# EAGLE board elk-board (EAGLE 9.4.2), part 1 of 3
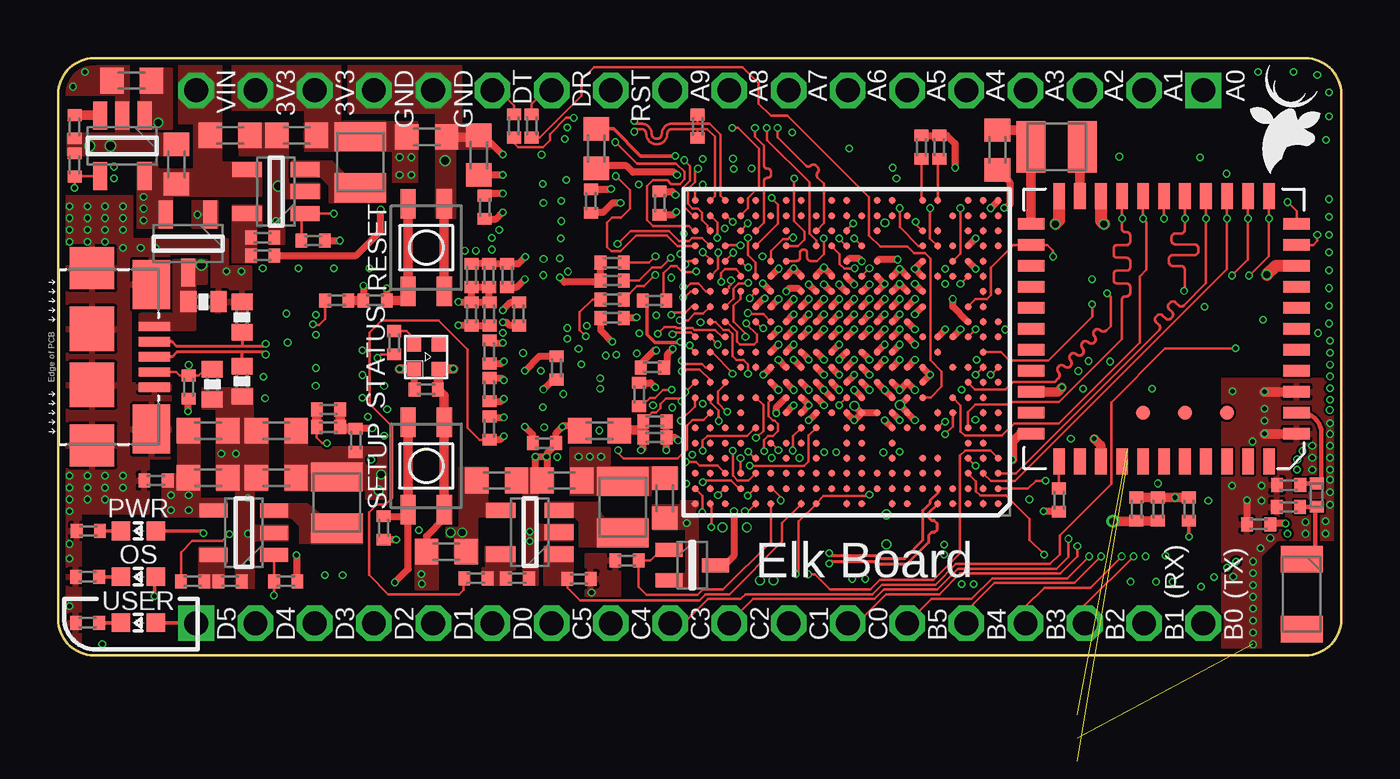
[diagram p8: board, top side]
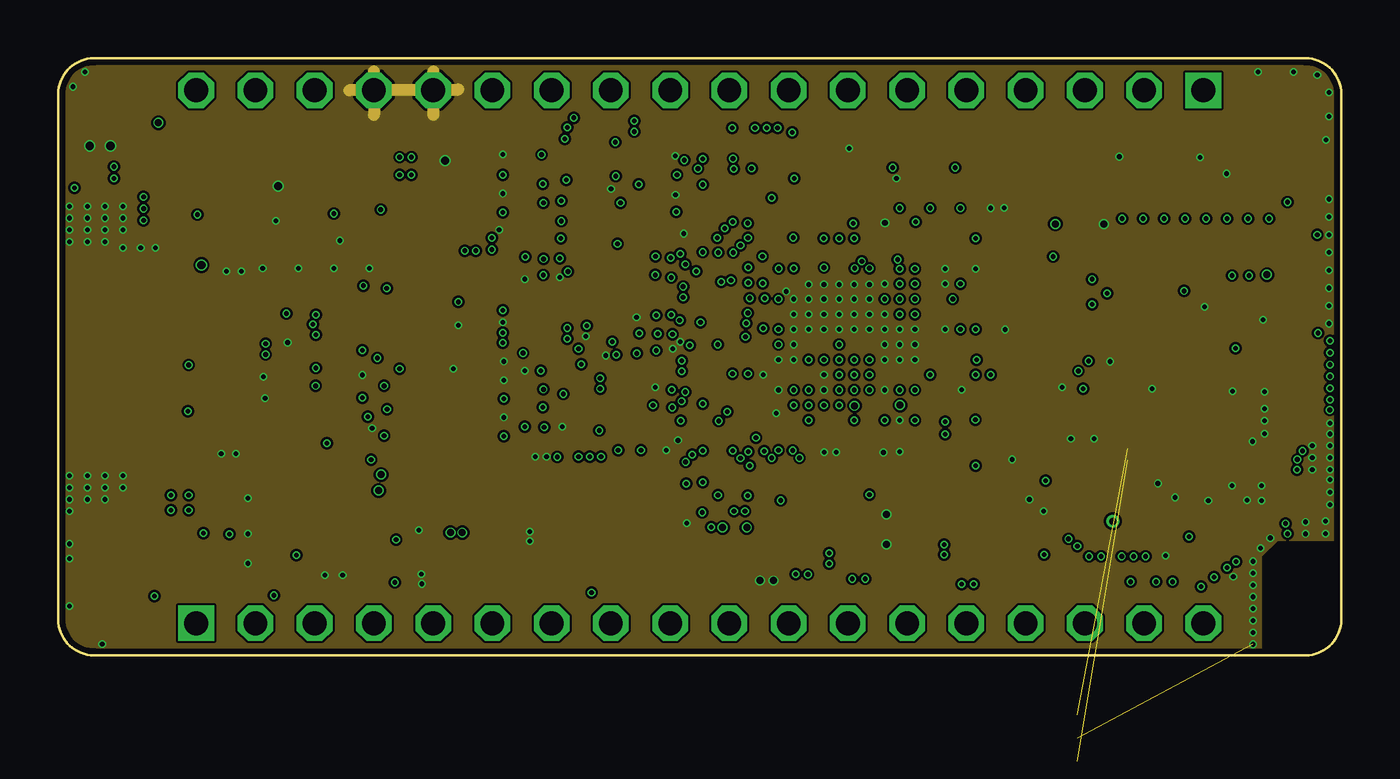
[diagram p9: board, inner layer GND1]
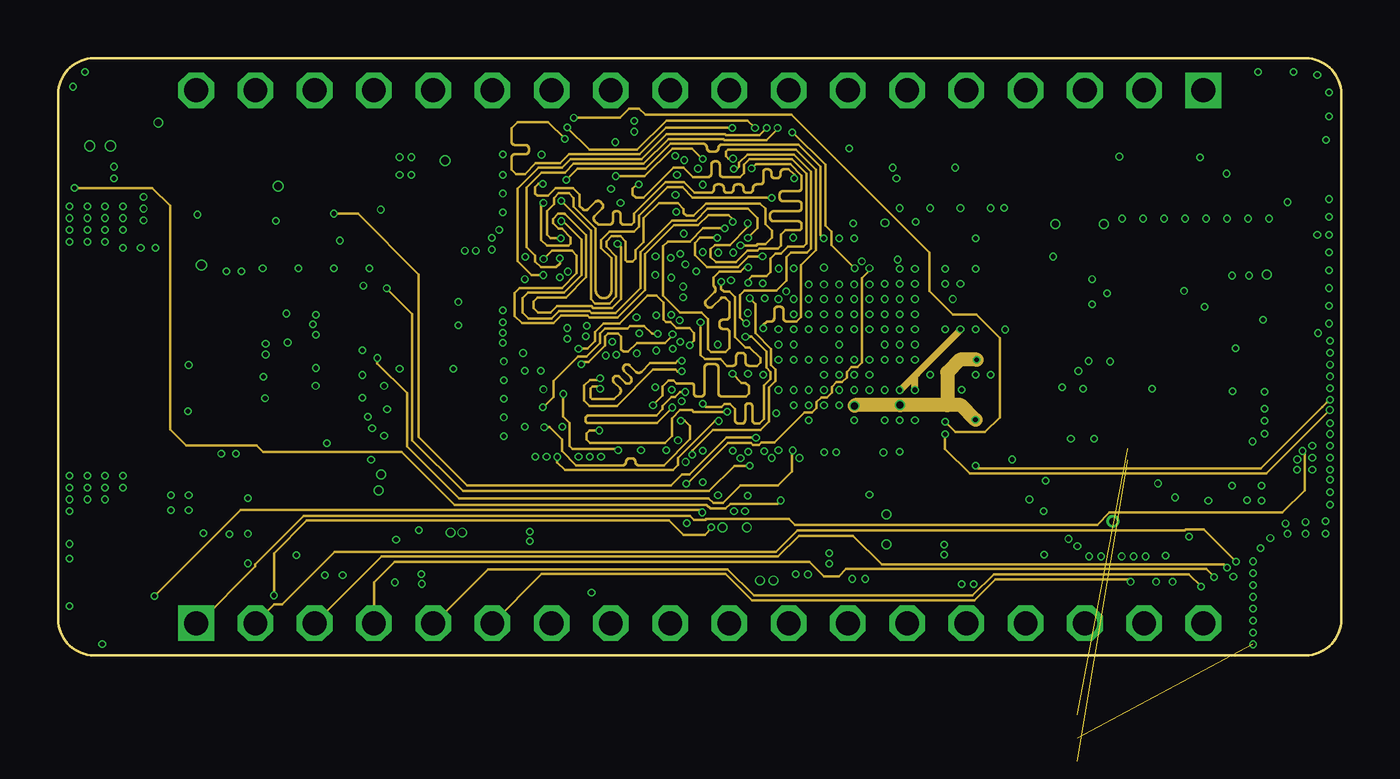
[diagram p10: board, inner layer SIG1_RAM]
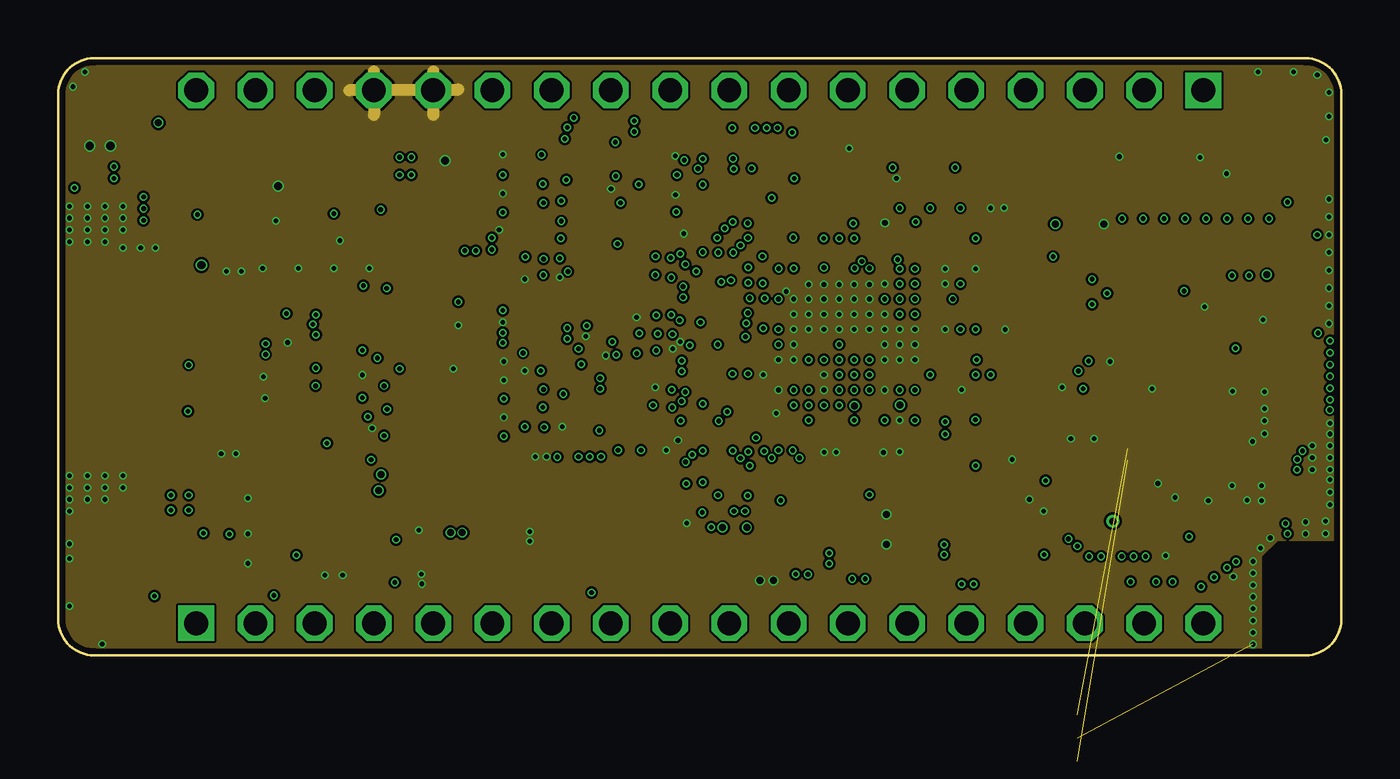
[diagram p11: board, inner layer GND2]
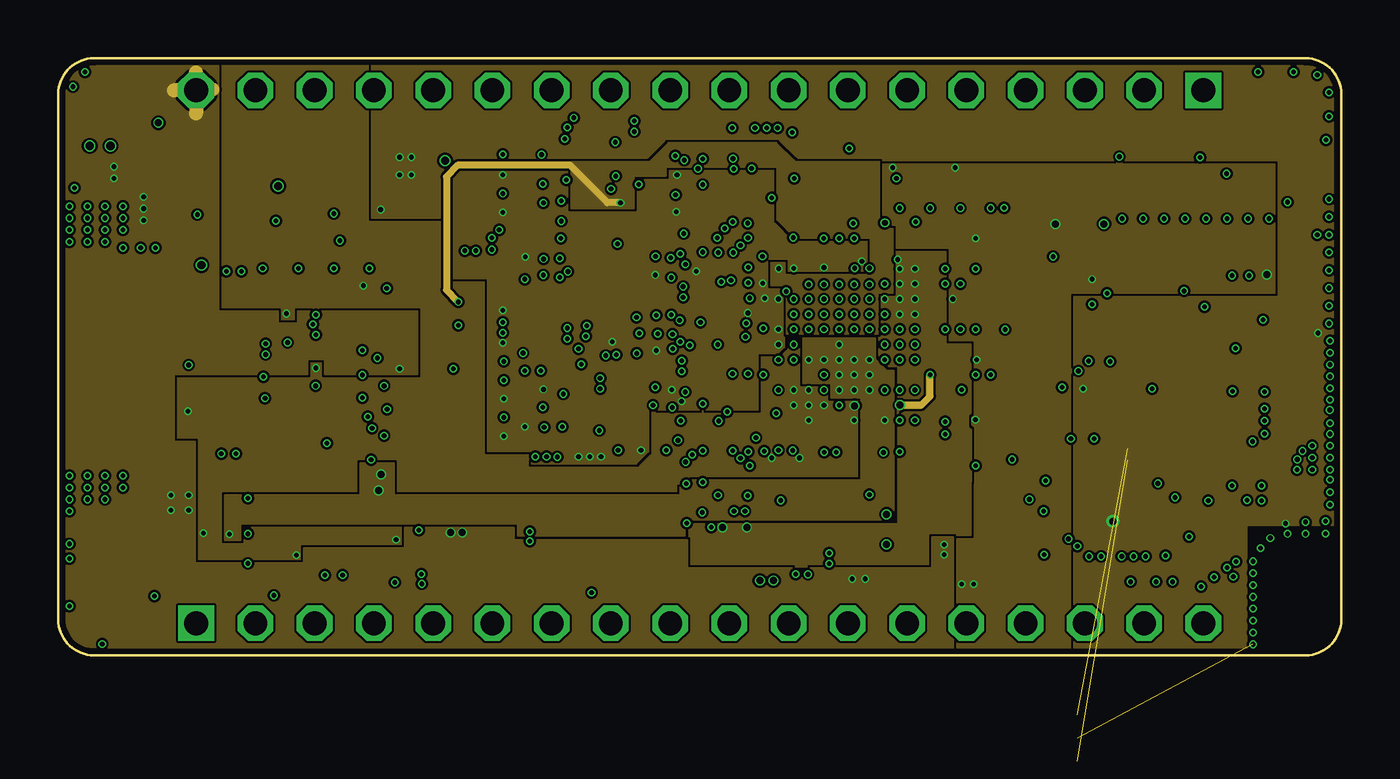
[diagram p12: board, inner layer PWR]
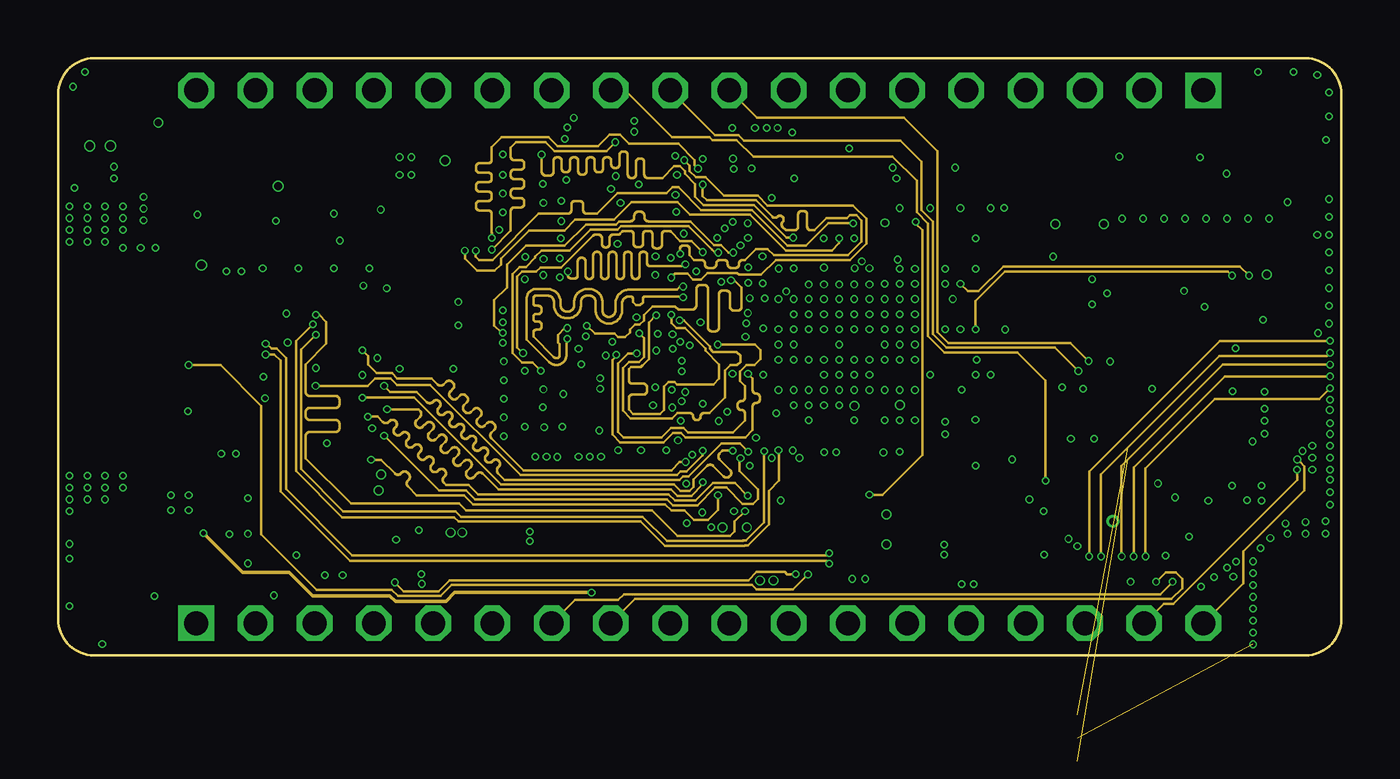
[diagram p13: board, inner layer SIG2_RAM]
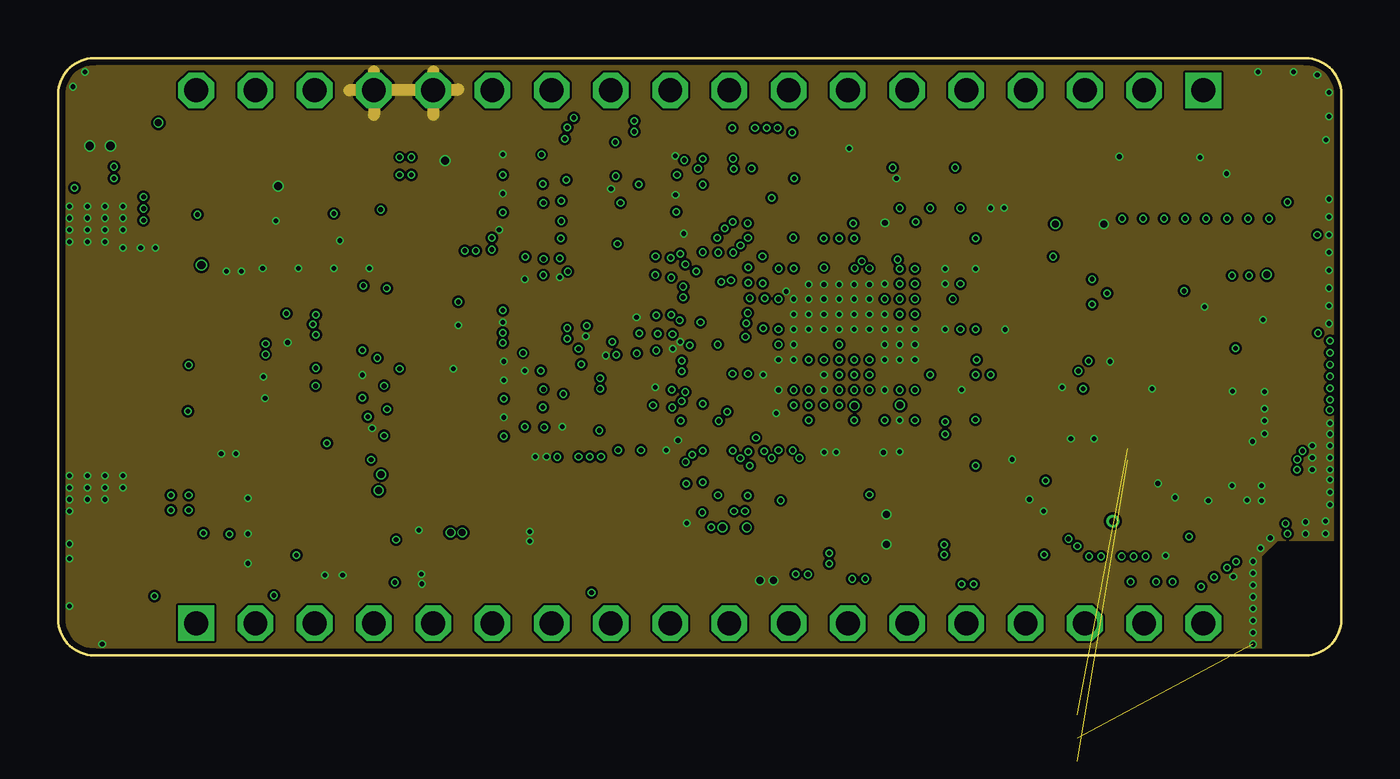
[diagram p14: board, inner layer GND3]
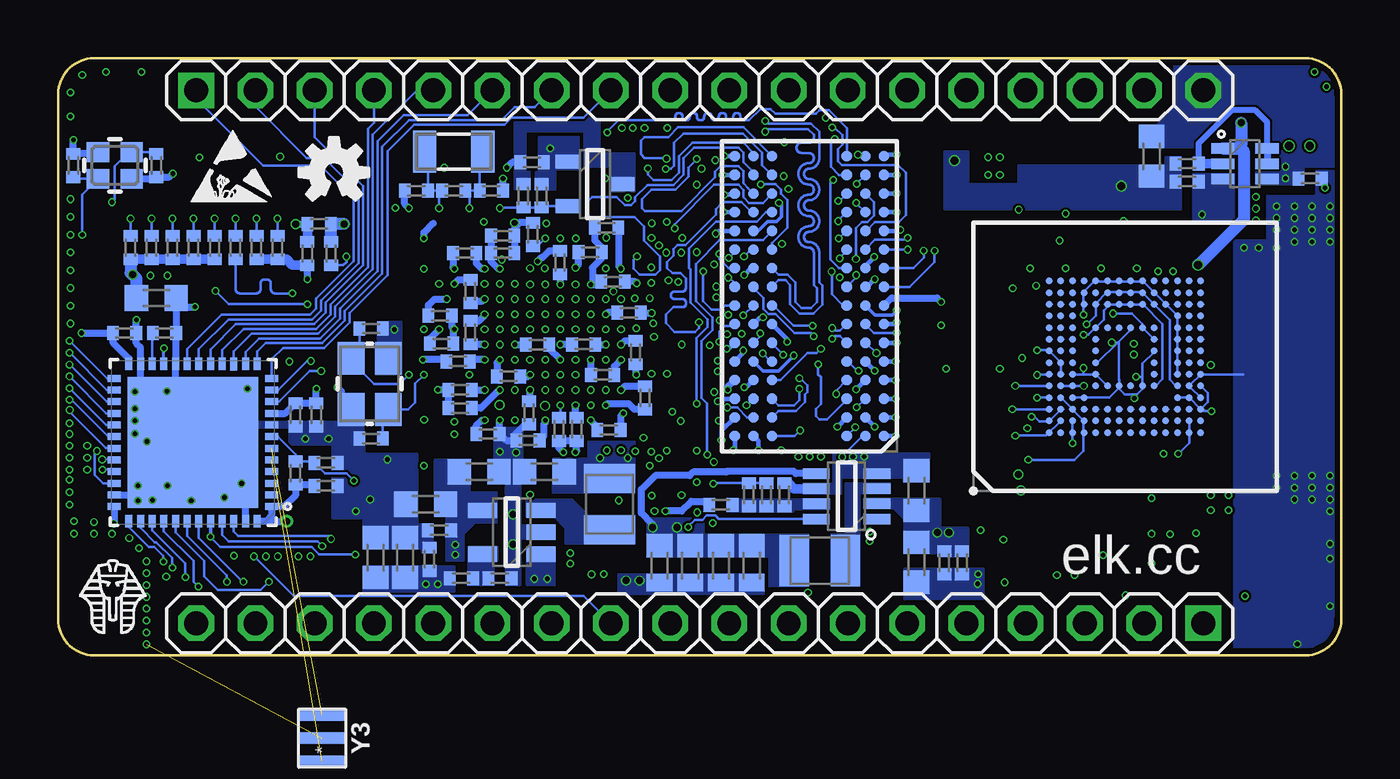
[diagram p15: board, bottom side, seen from below]

Size 55 x 25.6 mm. Coordinates in mm from the lower left corner, seen from the top.
Outline: 55,1.52 55,24.08 arc90 53.48,25.6 1.52,25.6 arc90 0,24.08 0,1.52 arc90 1.52,0 53.48,0 arc90 55,1.52
Copper layers (1*2+3*4+13*14+15*16): Top 0.035mm / dielectric 0.1mm / GND1 0.035mm / dielectric 0.18mm / SIG1_RAM 0.035mm / dielectric 0.2mm / GND2 0.035mm / dielectric 0.33mm / PWR 0.035mm / dielectric 0.2mm / SIG2_RAM 0.035mm / dielectric 0.18mm / GND3 0.035mm / dielectric 0.1mm / Bottom 0.035mm
Design rules "Olinuxino H3 *": minimum track width 4mil, minimum drill 0.2mm, track to track 4mil, track to pad 4mil, pad to pad 4mil, via to via 4mil, smd to smd 0mil, copper to edge 10mil, drill to drill 8mil, minimum pad ring 6mil, minimum via ring 2.5mil, stop-mask expansion 2mil, vias tented up to drill 25mil, thermal gap 5mil
Net classes: 1 DRAM_ADD_CMD: width 0.102 mm; 5 DRAM_CLOCK: width 0.114 mm, clearance 0.305 mm to class 0, clearance 0.305 mm to class 1, clearance 0.305 mm to class 2, clearance 0.305 mm to class 3, clearance 0.305 mm to class 4, clearance 0.121 mm; 6 DIFF100: width 0.114 mm, clearance 0.305 mm to class 0, clearance 0.305 mm to class 1, clearance 0.305 mm to class 2, clearance 0.305 mm to class 3, clearance 0.305 mm to class 4, clearance 0.305 mm to class 5, clearance 0.121 mm; 7 DIFF90: width 0.135 mm, clearance 0.305 mm to class 0, clearance 0.305 mm to class 1, clearance 0.305 mm to class 2, clearance 0.305 mm to class 3, clearance 0.305 mm to class 4, clearance 0.305 mm to class 5, clearance 0.305 mm to class 6, clearance 0.109 mm; 8 SDC2: clearance 0.305 mm to class 5, clearance 0.305 mm to class 6, clearance 0.305 mm to class 7; 9 SDC1: clearance 0.305 mm to class 5, clearance 0.305 mm to class 6, clearance 0.305 mm to class 7; 10 1.2V: clearance 0.305 mm to class 5, clearance 0.305 mm to class 6, clearance 0.305 mm to class 7; 11 1.5V: clearance 0.305 mm to class 5, clearance 0.305 mm to class 6, clearance 0.305 mm to class 7; 12 3.3V: clearance 0.305 mm to class 5, clearance 0.305 mm to class 6, clearance 0.305 mm to class 7; 13 Antenna: width 0.179 mm, clearance 0.102 mm to class 0, clearance 0.305 mm to class 5, clearance 0.305 mm to class 6, clearance 0.305 mm to class 7; 14 MPU_X24M: clearance 0.305 mm to class 5, clearance 0.305 mm to class 6, clearance 0.305 mm to class 7; 15 MPU_X32K: clearance 0.305 mm to class 5, clearance 0.305 mm to class 6, clearance 0.305 mm to class 7

## Footprints (pad centres in the part's own frame; a part is rotated, then mirrored left to right if it is on the bottom)
ANTC3216X140N = smd 1.15 x 1.8: 1 -1.5,0; 2 1.5,0
0402 = smd 0.5 x 0.6: 1 -0.5,0; 2 0.5,0
0603 = smd 1 x 1.1: 1 -0.85,0; 2 0.85,0
TOLBA_0603 = smd 1 x 1.1: 1 -0.85,0 | smd 0.75 x 1.1: 2 0.725,0
BGA153C50P14X14_1150X1300X80 = smd 0.29 x 0.29: A1 -3.25,3.25; A2 -2.75,3.25; A3 -2.25,3.25; A4 -1.75,3.25; A5 -1.25,3.25; A6 -0.75,3.25; A7 -0.25,3.25; A8 0.25,3.25; A9 0.75,3.25; A10 1.25,3.25; A11 1.75,3.25; A12 2.25,3.25; A13 2.75,3.25; A14 3.25,3.25; B1 -3.25,2.75; B2 -2.75,2.75; B3 -2.25,2.75; B4 -1.75,2.75; B5 -1.25,2.75; B6 -0.75,2.75; B7 -0.25,2.75; B8 0.25,2.75; B9 0.75,2.75; B10 1.25,2.75; B11 1.75,2.75; B12 2.25,2.75; B13 2.75,2.75; B14 3.25,2.75; C1 -3.25,2.25; C2 -2.75,2.25; C3 -2.25,2.25; C4 -1.75,2.25; C5 -1.25,2.25; C6 -0.75,2.25; C7 -0.25,2.25; C8 0.25,2.25; C9 0.75,2.25; C10 1.25,2.25; C11 1.75,2.25; C12 2.25,2.25; C13 2.75,2.25; C14 3.25,2.25; D1 -3.25,1.75; D2 -2.75,1.75; D3 -2.25,1.75; D4 -1.75,1.75; D12 2.25,1.75; D13 2.75,1.75; D14 3.25,1.75; E1 -3.25,1.25; E2 -2.75,1.25; E3 -2.25,1.25; E5 -1.25,1.25; E6 -0.75,1.25; E7 -0.25,1.25; E8 0.25,1.25; E9 0.75,1.25; E10 1.25,1.25; E12 2.25,1.25; E13 2.75,1.25; E14 3.25,1.25; F1 -3.25,0.75; F2 -2.75,0.75; F3 -2.25,0.75; F5 -1.25,0.75; F10 1.25,0.75; F12 2.25,0.75; F13 2.75,0.75; F14 3.25,0.75; G1 -3.25,0.25; G2 -2.75,0.25; G3 -2.25,0.25; G5 -1.25,0.25; G10 1.25,0.25; G12 2.25,0.25; G13 2.75,0.25; G14 3.25,0.25; H1 -3.25,-0.25; H2 -2.75,-0.25; H3 -2.25,-0.25; H5 -1.25,-0.25; H10 1.25,-0.25; H12 2.25,-0.25; H13 2.75,-0.25; H14 3.25,-0.25; J1 -3.25,-0.75; J2 -2.75,-0.75; J3 -2.25,-0.75; J5 -1.25,-0.75; J10 1.25,-0.75; J12 2.25,-0.75; J13 2.75,-0.75; J14 3.25,-0.75; K1 -3.25,-1.25; K2 -2.75,-1.25; K3 -2.25,-1.25; K5 -1.25,-1.25; K6 -0.75,-1.25; K7 -0.25,-1.25; K8 0.25,-1.25; K9 0.75,-1.25; K10 1.25,-1.25; K12 2.25,-1.25; K13 2.75,-1.25; K14 3.25,-1.25; L1 -3.25,-1.75; L2 -2.75,-1.75; L3 -2.25,-1.75; L12 2.25,-1.75; L13 2.75,-1.75; L14 3.25,-1.75; M1 -3.25,-2.25; M2 -2.75,-2.25; M3 -2.25,-2.25; M4 -1.75,-2.25; M5 -1.25,-2.25; M6 -0.75,-2.25; M7 -0.25,-2.25; M8 0.25,-2.25; M9 0.75,-2.25; M10 1.25,-2.25; M11 1.75,-2.25; M12 2.25,-2.25; M13 2.75,-2.25; M14 3.25,-2.25; N1 -3.25,-2.75; N2 -2.75,-2.75; N3 -2.25,-2.75; N4 -1.75,-2.75; N5 -1.25,-2.75; N6 -0.75,-2.75; N7 -0.25,-2.75; N8 0.25,-2.75; N9 0.75,-2.75; N10 1.25,-2.75; N11 1.75,-2.75; N12 2.25,-2.75; N13 2.75,-2.75; N14 3.25,-2.75; P1 -3.25,-3.25; P2 -2.75,-3.25; P3 -2.25,-3.25; P4 -1.75,-3.25; P5 -1.25,-3.25; P6 -0.75,-3.25; P7 -0.25,-3.25; P8 0.25,-3.25; P9 0.75,-3.25; P10 1.25,-3.25; P11 1.75,-3.25; P12 2.25,-3.25; P13 2.75,-3.25; P14 3.25,-3.25
BGA347C65P21X21_1400X1400X118 = smd 0.3 x 0.3: A1 -6.5,6.5; A2 -5.85,6.5; A3 -5.2,6.5; A4 -4.55,6.5; A5 -3.9,6.5; A7 -2.6,6.5; A8 -1.95,6.5; A10 -0.65,6.5; A11 0,6.5; A13 1.3,6.5; A14 1.95,6.5; A16 3.25,6.5; A17 3.9,6.5; A19 5.2,6.5; A20 5.85,6.5; A21 6.5,6.5; AA1 -6.5,-6.5; AA2 -5.85,-6.5; AA3 -5.2,-6.5; AA5 -3.9,-6.5; AA6 -3.25,-6.5; AA8 -1.95,-6.5; AA9 -1.3,-6.5; AA11 0,-6.5; AA12 0.65,-6.5; AA14 1.95,-6.5; AA15 2.6,-6.5; AA17 3.9,-6.5; AA18 4.55,-6.5; AA19 5.2,-6.5; AA20 5.85,-6.5; AA21 6.5,-6.5; B1 -6.5,5.85; B2 -5.85,5.85; B3 -5.2,5.85; B4 -4.55,5.85; B5 -3.9,5.85; B6 -3.25,5.85; B7 -2.6,5.85; B8 -1.95,5.85; B9 -1.3,5.85; B10 -0.65,5.85; B11 0,5.85; B12 0.65,5.85; B13 1.3,5.85; B14 1.95,5.85; B15 2.6,5.85; B16 3.25,5.85; B17 3.9,5.85; B18 4.55,5.85; B19 5.2,5.85; B20 5.85,5.85; B21 6.5,5.85; C1 -6.5,5.2; C2 -5.85,5.2; C3 -5.2,5.2; C5 -3.9,5.2; C6 -3.25,5.2; C7 -2.6,5.2; C8 -1.95,5.2; C9 -1.3,5.2; C10 -0.65,5.2; C11 0,5.2; C12 0.65,5.2; C13 1.3,5.2; C14 1.95,5.2; C15 2.6,5.2; C16 3.25,5.2; C17 3.9,5.2; C18 4.55,5.2; C19 5.2,5.2; C20 5.85,5.2; C21 6.5,5.2; D1 -6.5,4.55; D2 -5.85,4.55; D3 -5.2,4.55; D5 -3.9,4.55; D6 -3.25,4.55; D8 -1.95,4.55; D10 -0.65,4.55; D11 0,4.55; D13 1.3,4.55; D15 2.6,4.55; D17 3.9,4.55; D19 5.2,4.55; D20 5.85,4.55; E2 -5.85,3.9; E3 -5.2,3.9; E8 -1.95,3.9; E10 -0.65,3.9; E11 0,3.9; E13 1.3,3.9; E14 1.95,3.9; E15 2.6,3.9; E16 3.25,3.9; E18 4.55,3.9; E19 5.2,3.9; E20 5.85,3.9; E21 6.5,3.9; F1 -6.5,3.25; F2 -5.85,3.25; F3 -5.2,3.25; F5 -3.9,3.25; F6 -3.25,3.25; F7 -2.6,3.25; F8 -1.95,3.25; F10 -0.65,3.25; F11 0,3.25; F13 1.3,3.25; F14 1.95,3.25; F16 3.25,3.25; F17 3.9,3.25; F18 4.55,3.25; F19 5.2,3.25; F20 5.85,3.25; F21 6.5,3.25; G1 -6.5,2.6; G2 -5.85,2.6; G4 -4.55,2.6; G5 -3.9,2.6; G7 -2.6,2.6; G8 -1.95,2.6; G9 -1.3,2.6; G10 -0.65,2.6; G11 0,2.6; G12 0.65,2.6; G13 1.3,2.6; G14 1.95,2.6; G15 2.6,2.6; G18 4.55,2.6; G20 5.85,2.6; H2 -5.85,1.95; H3 -5.2,1.95; H4 -4.55,1.95; H6 -3.25,1.95; H7 -2.6,1.95; H8 -1.95,1.95; H10 -0.65,1.95; H11 0,1.95; H12 0.65,1.95; H13 1.3,1.95; H14 1.95,1.95; H15 2.6,1.95; H16 3.25,1.95; H17 3.9,1.95; H18 4.55,1.95; H19 5.2,1.95; H20 5.85,1.95; H21 6.5,1.95; J1 -6.5,1.3; J2 -5.85,1.3; J3 -5.2,1.3; J6 -3.25,1.3; J7 -2.6,1.3; J8 -1.95,1.3; J9 -1.3,1.3; J10 -0.65,1.3; J11 0,1.3; J12 0.65,1.3; J13 1.3,1.3; J14 1.95,1.3; J15 2.6,1.3; J16 3.25,1.3; J19 5.2,1.3; J20 5.85,1.3; J21 6.5,1.3; K1 -6.5,0.65; K2 -5.85,0.65; K3 -5.2,0.65; K4 -4.55,0.65; K6 -3.25,0.65; K7 -2.6,0.65; K8 -1.95,0.65; K9 -1.3,0.65; K10 -0.65,0.65; K11 0,0.65; K12 0.65,0.65; K13 1.3,0.65; K14 1.95,0.65; K15 2.6,0.65; K16 3.25,0.65; K17 3.9,0.65; K18 4.55,0.65; K20 5.85,0.65; L2 -5.85,0; L5 -3.9,0; L8 -1.95,0; L9 -1.3,0; L10 -0.65,0; L11 0,0; L12 0.65,0; L13 1.3,0; L14 1.95,0; L15 2.6,0; L16 3.25,0; L17 3.9,0; L18 4.55,0; L19 5.2,0; L20 5.85,0; L21 6.5,0; M1 -6.5,-0.65; M2 -5.85,-0.65; M3 -5.2,-0.65; M4 -4.55,-0.65; M5 -3.9,-0.65; M6 -3.25,-0.65; M7 -2.6,-0.65; M8 -1.95,-0.65; M9 -1.3,-0.65; M10 -0.65,-0.65; M11 0,-0.65; M12 0.65,-0.65; M13 1.3,-0.65; M14 1.95,-0.65; M15 2.6,-0.65; M16 3.25,-0.65; M19 5.2,-0.65; M20 5.85,-0.65; M21 6.5,-0.65; N1 -6.5,-1.3; N2 -5.85,-1.3; N3 -5.2,-1.3; N7 -2.6,-1.3; N8 -1.95,-1.3; N9 -1.3,-1.3; N10 -0.65,-1.3; N11 0,-1.3; N12 0.65,-1.3; N13 1.3,-1.3; N14 1.95,-1.3; N15 2.6,-1.3; N16 3.25,-1.3; N17 3.9,-1.3; N19 5.2,-1.3; N20 5.85,-1.3; P2 -5.85,-1.95; P3 -5.2,-1.95; P6 -3.25,-1.95; P7 -2.6,-1.95; P8 -1.95,-1.95; P9 -1.3,-1.95; P10 -0.65,-1.95; P11 0,-1.95; P12 0.65,-1.95; P13 1.3,-1.95; P14 1.95,-1.95; P15 2.6,-1.95; P16 3.25,-1.95; P17 3.9,-1.95; P19 5.2,-1.95; P20 5.85,-1.95; P21 6.5,-1.95; R1 -6.5,-2.6; R2 -5.85,-2.6; R6 -3.25,-2.6; R7 -2.6,-2.6; R8 -1.95,-2.6; R9 -1.3,-2.6; R10 -0.65,-2.6; R11 0,-2.6; R12 0.65,-2.6; R13 1.3,-2.6; R14 1.95,-2.6; R16 3.25,-2.6; R17 3.9,-2.6; R18 4.55,-2.6; R19 5.2,-2.6; R20 5.85,-2.6; R21 6.5,-2.6; T2 -5.85,-3.25; T3 -5.2,-3.25; T4 -4.55,-3.25; T5 -3.9,-3.25; T6 -3.25,-3.25; T7 -2.6,-3.25; T8 -1.95,-3.25; T9 -1.3,-3.25; T10 -0.65,-3.25; T11 0,-3.25; T12 0.65,-3.25; T13 1.3,-3.25; T14 1.95,-3.25; T15 2.6,-3.25; T16 3.25,-3.25; T17 3.9,-3.25; T18 4.55,-3.25; T20 5.85,-3.25; U2 -5.85,-3.9; U3 -5.2,-3.9; U4 -4.55,-3.9; U6 -3.25,-3.9; U9 -1.3,-3.9; U11 0,-3.9; U15 2.6,-3.9; U16 3.25,-3.9; U18 4.55,-3.9; U19 5.2,-3.9; U20 5.85,-3.9; U21 6.5,-3.9; V1 -6.5,-4.55; V2 -5.85,-4.55; V3 -5.2,-4.55; V4 -4.55,-4.55; V5 -3.9,-4.55; V6 -3.25,-4.55; V10 -0.65,-4.55; V11 0,-4.55; V12 0.65,-4.55; V13 1.3,-4.55; V15 2.6,-4.55; V17 3.9,-4.55; V19 5.2,-4.55; V20 5.85,-4.55; V21 6.5,-4.55; W1 -6.5,-5.2; W2 -5.85,-5.2; W3 -5.2,-5.2; W5 -3.9,-5.2; W6 -3.25,-5.2; W9 -1.3,-5.2; W11 0,-5.2; W12 0.65,-5.2; W13 1.3,-5.2; W15 2.6,-5.2; W17 3.9,-5.2; W18 4.55,-5.2; W20 5.85,-5.2; W21 6.5,-5.2; Y1 -6.5,-5.85; Y2 -5.85,-5.85; Y3 -5.2,-5.85; Y4 -4.55,-5.85; Y7 -2.6,-5.85; Y8 -1.95,-5.85; Y9 -1.3,-5.85; Y10 -0.65,-5.85; Y11 0,-5.85; Y12 0.65,-5.85; Y13 1.3,-5.85; Y14 1.95,-5.85; Y15 2.6,-5.85; Y16 3.25,-5.85; Y17 3.9,-5.85; Y18 4.55,-5.85; Y19 5.2,-5.85; Y20 5.85,-5.85; Y21 6.5,-5.85
SOT95P285X140-5N = smd 1.2 x 0.6: 1 -1.3,0.95; 2 -1.3,0; 3 -1.3,-0.95; 4 1.3,-0.95; 5 1.3,0.95
BGA96C80P9X16_1000X1330X120 = smd 0.44 x 0.44: A1 -3.2,6; A2 -2.4,6; A3 -1.6,6; A7 1.6,6; A8 2.4,6; A9 3.2,6; B1 -3.2,5.2; B2 -2.4,5.2; B3 -1.6,5.2; B7 1.6,5.2; B8 2.4,5.2; B9 3.2,5.2; C1 -3.2,4.4; C2 -2.4,4.4; C3 -1.6,4.4; C7 1.6,4.4; C8 2.4,4.4; C9 3.2,4.4; D1 -3.2,3.6; D2 -2.4,3.6; D3 -1.6,3.6; D7 1.6,3.6; D8 2.4,3.6; D9 3.2,3.6; E1 -3.2,2.8; E2 -2.4,2.8; E3 -1.6,2.8; E7 1.6,2.8; E8 2.4,2.8; E9 3.2,2.8; F1 -3.2,2; F2 -2.4,2; F3 -1.6,2; F7 1.6,2; F8 2.4,2; F9 3.2,2; G1 -3.2,1.2; G2 -2.4,1.2; G3 -1.6,1.2; G7 1.6,1.2; G8 2.4,1.2; G9 3.2,1.2; H1 -3.2,0.4; H2 -2.4,0.4; H3 -1.6,0.4; H7 1.6,0.4; H8 2.4,0.4; H9 3.2,0.4; J1 -3.2,-0.4; J2 -2.4,-0.4; J3 -1.6,-0.4; J7 1.6,-0.4; J8 2.4,-0.4; J9 3.2,-0.4; K1 -3.2,-1.2; K2 -2.4,-1.2; K3 -1.6,-1.2; K7 1.6,-1.2; K8 2.4,-1.2; K9 3.2,-1.2; L1 -3.2,-2; L2 -2.4,-2; L3 -1.6,-2; L7 1.6,-2; L8 2.4,-2; L9 3.2,-2; M1 -3.2,-2.8; M2 -2.4,-2.8; M3 -1.6,-2.8; M7 1.6,-2.8; M8 2.4,-2.8; M9 3.2,-2.8; N1 -3.2,-3.6; N2 -2.4,-3.6; N3 -1.6,-3.6; N7 1.6,-3.6; N8 2.4,-3.6; N9 3.2,-3.6; P1 -3.2,-4.4; P2 -2.4,-4.4; P3 -1.6,-4.4; P7 1.6,-4.4; P8 2.4,-4.4; P9 3.2,-4.4; R1 -3.2,-5.2; R2 -2.4,-5.2; R3 -1.6,-5.2; R7 1.6,-5.2; R8 2.4,-5.2; R9 3.2,-5.2; T1 -3.2,-6; T2 -2.4,-6; T3 -1.6,-6; T7 1.6,-6; T8 2.4,-6; T9 3.2,-6
SOT94P280X100-5N = smd 1.25 x 0.65: 1 -1.25,0.94; 2 -1.25,0; 3 -1.25,-0.94; 4 1.25,-0.94; 5 1.25,0.94
SOT96P237X111-3N = smd 1 x 0.6: 1 -1.2,0.955; 2 -1.2,-0.955; 3 1.2,0
SOT65P280X100-8N = smd 1.15 x 0.45: 1 -1.3,0.975; 2 -1.3,0.325; 3 -1.3,-0.325; 4 -1.3,-0.975; 5 1.3,-0.975; 6 1.3,-0.325; 7 1.3,0.325; 8 1.3,0.975
1X18-S = drill 1.016 square: 1 -21.59,0 | drill 1.016 octagon: 2 -19.05,0; 3 -16.51,0; 4 -13.97,0; 5 -11.43,0; 6 -8.89,0; 7 -6.35,0; 8 -3.81,0; 9 -1.27,0; 10 1.27,0; 11 3.81,0; 12 6.35,0; 13 8.89,0; 14 11.43,0; 15 13.97,0; 16 16.51,0; 17 19.05,0; 18 21.59,0
INDC2520X100N = smd 1.25 x 2.2: 1 -1.1,0; 2 1.1,0
RESC0402_L = smd 0.5 x 0.6: 1 -0.5,0; 2 0.5,0
0603-LED = smd 0.8 x 0.8: A 0,0.75; K 0,-0.75
LTST-E263CEGBK = smd 0.6 x 0.6: 1 -0.52,-0.52; 2 -0.52,0.52; 3 0.52,0.52; 4 0.52,-0.52
SOT95P280X125-3N = smd 1.2 x 0.6: 1 -1.25,0.95; 2 -1.25,-0.95; 3 1.25,0
SOT65P210X110-6N = smd 1 x 0.45: 1 -0.95,0.65; 2 -0.95,0; 3 -0.95,-0.65; 4 0.95,-0.65; 5 0.95,0; 6 0.95,0.65
3.2X1.5 = smd 1 x 1.8: 1 -1.25,0; 2 1.25,0
SOT65P220X100-3N = smd 1.15 x 0.6: 1 -1,0.65; 2 -1,-0.65; 3 1,0
TACTILE_SWITCH_SMD = smd 1.25 x 0.65: 1 -1.875,0.775; 2 1.875,0.775; 3 -1.875,-0.775; 4 1.875,-0.775
AP6212 = smd 1.125 x 0.5: 1 -5.688,4.5; 2 -5.688,3.6; 3 -5.688,2.7; 4 -5.688,1.8; 5 -5.688,0.9; 6 -5.688,0; 7 -5.688,-0.9; 8 -5.688,-1.8; 9 -5.688,-2.7; 10 -5.688,-3.6; 11 -5.688,-4.5; 23 5.688,-4.5; 24 5.688,-3.6; 25 5.688,-2.7; 26 5.688,-1.8; 27 5.688,-0.9; 28 5.688,0; 29 5.688,0.9; 30 5.688,1.8; 31 5.688,2.7; 32 5.688,3.6; 33 5.688,4.5 | smd 0.5 x 1.125: 12 -4.5,-5.688; 13 -3.6,-5.688; 14 -2.7,-5.688; 15 -1.8,-5.688; 16 -0.9,-5.688; 17 0,-5.688; 18 0.9,-5.688; 19 1.8,-5.688; 20 2.7,-5.688; 21 3.6,-5.688; 22 4.5,-5.688; 34 4.5,5.688; 35 3.6,5.688; 36 2.7,5.688; 37 1.8,5.688; 38 0.9,5.688; 39 0,5.688; 40 -0.9,5.688; 41 -1.8,5.688; 42 -2.7,5.688; 43 -3.6,5.688; 44 -4.5,5.688 | smd 0.6 x 0.6: TP1 -2.7,3.6; TP2 -0.9,3.6; TP3 0.9,3.6
UFQFPN-48 = smd 0.55 x 0.3: 1 -3.375,2.75; 2 -3.375,2.25; 3 -3.375,1.75; 4 -3.375,1.25; 5 -3.375,0.75; 6 -3.375,0.25; 7 -3.375,-0.25; 8 -3.375,-0.75; 9 -3.375,-1.25; 10 -3.375,-1.75; 11 -3.375,-2.25; 12 -3.375,-2.75; 25 3.375,-2.75; 26 3.375,-2.25; 27 3.375,-1.75; 28 3.375,-1.25; 29 3.375,-0.75; 30 3.375,-0.25; 31 3.375,0.25; 32 3.375,0.75; 33 3.375,1.25; 34 3.375,1.75; 35 3.375,2.25; 36 3.375,2.75 | smd 0.3 x 0.55: 13 -2.75,-3.375; 14 -2.25,-3.375; 15 -1.75,-3.37; 16 -1.25,-3.375; 17 -0.75,-3.375; 18 -0.25,-3.375; 19 0.25,-3.375; 20 0.75,-3.375; 21 1.25,-3.375; 22 1.75,-3.375; 23 2.25,-3.375; 24 2.75,-3.375; 37 2.75,3.375; 38 2.25,3.375; 39 1.75,3.375; 40 1.25,3.375; 41 0.75,3.375; 42 0.25,3.375; 43 -0.25,3.375; 44 -0.75,3.375; 45 -1.25,3.375; 46 -1.75,3.375; 47 -2.25,3.375; 48 -2.75,3.375 | smd 5.6 x 5.6: 49 0,0
10118192-0001LF(MICRO-USB-B-AMPHENOL-FCI) = smd 1.8 x 1.9: CGND1 -3.8,0; CGND4 3.8,0 | smd 1.9 x 1.9: CGND2 -1.2,0; CGND3 1.2,0 | smd 2.1 x 1.6: CGND5 3.1,2.55; CGND6 -3.1,2.55 | smd 0.4 x 1.35: D+ 0,2.675; D- -0.65,2.675; GND 1.3,2.675; ID 0.65,2.675; VBUS -1.3,2.675
4-SMD-2X1.6MM = smd 0.95 x 0.85: 1 -0.725,-0.575; 2 0.725,-0.575; 3 0.725,0.575; 4 -0.725,0.575
CRYSTAL-SMD-3.2X2.5MM-EPSON-TSX-3225 = smd 1.4 x 1.15: 1 -1.1,-0.8; 2 1.1,-0.8; 3 1.1,0.8; 4 -1.1,0.8
CSTCW25M0X53-R0 = smd 0.5 x 2: GND 0,0; IN 1,0; OUT -1,0
0402-RES = smd 0.7 x 0.9: 1 -0.65,0; 2 0.65,0

## Placement (x,y rotation side)
ANT1  AMCA31-2R450G-S1F-T3  [ANTC3216X140N]  53.3,2.62 270 top
C1  100nF  [0402]  44.32,17.23 270 bottom
C2  1uF  [0402]  37.77,11.38 180 bottom
C3  100nF  [0402]  11.58,9.78 180 top
C4  100nF  [0402]  37.77,10.59 180 bottom
C5  10uF  [0603]  41.39,4.19 90 bottom
C6  1uF  [0402]  32.2,17.28 0 bottom
C7  100nF  [0402]  11.58,10.54 180 top
C8  1uF  [0402]  37.86,12.6 0 bottom
C9  1uF  [0402]  31.21,16.02 180 bottom
C10  100nF  [0402]  29.85,11.04 90 bottom
C11  100nF  [0402]  33.49,16.84 270 bottom
C12  100nF  [0402]  30.53,14.69 180 bottom
C13  100nF  [0402]  31.39,9.66 0 bottom
C14  12pF  [0402]  54.36,21.01 270 bottom
C15  12pF  [0402]  50.8,21.01 90 bottom
C16  10uF  [0603]  3.15,24.64 180 top
C17  10uF  [TOLBA_0603]  25.28,3.85 270 bottom
C18  10uF  [TOLBA_0603]  26.59,3.85 270 bottom
C19  1uF  [0402]  35.7,11.96 180 bottom
C20  1uF  [0402]  34.46,13.32 180 bottom
C21  1uF  [0402]  37.58,17.25 180 bottom
C22  1.5pF  [0402]  52.75,7.3 0 top
C23  1uF  [0402]  31.66,12.03 0 bottom
C24  100nF  [0402]  37.33,13.84 270 bottom
C25  10uF  [0603]  40.26,21.67 270 top
C26  100nF  [0402]  32.47,13.33 0 bottom
C27  [0402]  52.74,6.36 0 top
C28  100nF  [0402]  37.33,15.61 90 bottom
C29  100nF  [0402]  34.82,10.39 270 bottom
C30  100nF  [0402]  43.81,18.5 180 bottom
C31  100nF  [0402]  35.95,17.25 0 bottom
C32  22uF  [0603]  5.07,21.06 90 top
C33  100nF  [0402]  32.78,9.69 270 bottom
C34  10uF  [0603]  50.8,15.32 0 bottom
C35  100nF  [0402]  34.87,9.21 180 bottom
C36  100nF  [0402]  43.52,8.26 180 bottom
C37  100nF  [0402]  18.47,16.29 270 top
C38  100nF  [0402]  18.48,14.64 270 top
C39  4.7uF  [0402]  50.44,13.82 0 bottom
C40  10uF  [0603]  7.37,22.29 0 top
C41  10uF  [0603]  16.64,4.45 180 top
C42  10uF  [0603]  6.43,7.62 0 top
C43  10uF  [0603]  8.13,21.4 270 bottom
C44  10uF  [0603]  18.8,7.49 0 top
C45  10uF  [0603]  6.43,9.63 0 top
C46  100nF  [0402]  1.33,20.45 0 bottom
C47  100nF  [0402]  16.26,3.97 270 bottom
C48  100nF  [0402]  4.19,7.49 180 top
C49  12pF  [0402]  36.43,19.92 0 bottom
C50  12pF  [0402]  39.65,19.92 180 bottom
C51  100nF  [0402]  22.83,19.48 90 top
C52  100nF  [0402]  25.56,15.21 180 top
C53  4.7uF  [0402]  38.57,13.36 0 bottom
C54  100nF  [0402]  38.63,14.56 0 bottom
C55  100nF  [0402]  18.28,19.21 90 top
C56  10uF  [0603]  23.07,21.73 90 top
C57  1uF  [0402]  18.48,9.74 90 top
C58  100nF  [0402]  43.94,10.31 270 bottom
C59  10uF  [0603]  10.22,22.29 180 top
C60  4.7uF  [0402]  33.53,9.69 270 bottom
C61  100nF  [0402]  21.36,12.33 90 top
C62  1uF  [0402]  19.24,16.29 270 top
C63  10uF  [0603]  23.21,9.63 180 top
C64  10uF  [0603]  15.8,22.23 0 top
C65  10uF  [0603]  21.59,7.49 180 top
C66  10uF  [0603]  9.35,7.62 180 top
C67  1uF  [0402]  44.83,10.31 270 bottom
C68  100nF  [0402]  18.48,13.01 270 top
C69  1uF  [0402]  18.48,11.39 90 top
C70  100nF  [0402]  47.15,6.27 90 top
C71  10uF  [0603]  26.01,6.74 270 top
C72  10uF  [0603]  9.35,9.63 180 top
C73  10uF  [0603]  18.03,21.45 90 top
C74  100nF  [0402]  34.69,21.14 0 bottom
C75  100nF  [0402]  20.84,9.09 0 top
C76  1uF  [0402]  23.75,15.26 180 top
C77  100nF  [0402]  30.26,12.98 270 bottom
C78  100nF  [0402]  12.75,9.22 90 top
C79  100nF  [0402]  51.46,5.62 180 top
C80  100nF  [0402]  25.47,12.35 0 top
C81  1uF  [0402]  25.58,9.34 0 top
C82  100nF  [0402]  52.16,13.82 0 bottom
C83  100nF  [0402]  23.75,14.46 0 top
C84  1uF  [0402]  25.58,10.03 0 top
C85  100nF  [0402]  24.91,11.18 90 top
C86  100nF  [0402]  46.22,6.27 90 top
C87  18pF  [0402]  41.59,9.29 0 bottom
C88  18pF  [0402]  41.59,14.01 180 bottom
C89  100nF  [0402]  34.27,19.7 90 bottom
C90  100nF  [0402]  25.78,19.39 90 top
C91  4.7uF  [0402]  43.52,7.26 0 bottom
C92  100nF  [0402]  19.75,14.64 270 top
C93  10uF  [0603]  36.96,7.87 0 bottom
C94  10uF  [0603]  39.24,6.48 180 bottom
C95  100nF  [0402]  38.66,5.36 180 bottom
C96  10uF  [0603]  18.21,7.06 90 bottom
C97  10uF  [0603]  18.21,3.99 270 bottom
C98  100nF  [0402]  17.02,3.97 270 bottom
C99  100nF  [0402]  15.77,11.4 0 top
C100  10uF  [0603]  34.16,7.87 180 bottom
C101  10uF  [0603]  40.13,4.19 90 bottom
C102  100nF  [0402]  39.09,4.11 90 bottom
C103  22pF  [0402]  25.4,6.88 270 bottom
C104  100nF  [0402]  31.5,18.33 180 bottom
C105  10uF  [TOLBA_0603]  27.91,3.85 270 bottom
C106  10uF  [TOLBA_0603]  29.23,3.85 270 bottom
C107  100nF  [0402]  35.95,17.99 0 bottom
C108  100nF  [0402]  36.58,9.49 0 bottom
IC1  KLM8G1GESD-B03P  [BGA153C50P14X14_1150X1300X80]  9.27,12.8 90 bottom
IC2  ALLWINNER--H3  [BGA347C65P21X21_1400X1400X118]  33.8,13 180 top
IC3  SY6280  [SOT95P285X140-5N]  2.75,21.84 270 top
IC4  K4B4G1646D-BCK0  [BGA96C80P9X16_1000X1330X120]  22.8,15.4 180 bottom
IC5  RT8059GJ5  [SOT94P280X100-5N]  9.33,19.88 180 top
IC6  RT8059GJ5  [SOT94P280X100-5N]  20.22,5.28 180 top
IC7  SY8089A  [SOT95P285X140-5N]  7.95,5.26 180 top
IC8  NCP803SN263T1G  [SOT96P237X111-3N]  31.99,20.21 0 bottom
IC9  RT8059GJ5  [SOT94P280X100-5N]  35.56,5.28 180 bottom
IC10  MP2143DJ-LF-P  [SOT65P280X100-8N]  21.21,6.82 180 bottom
JP2  [1X18-S]  27.5,1.37 180 bottom
JP3  [1X18-S]  27.5,24.23 0 bottom
L1  DFE252010P-4R7M=P2  [INDC2520X100N]  42.8,21.8 180 top
L2  3.9nH  [RESC0402_L]  53.94,6.86 270 top
L3  DFE252010P-2R2M=P2  [INDC2520X100N]  12.95,21.15 90 top
L4  DFE252010P-2R2M=P2  [INDC2520X100N]  24.21,6.35 90 top
L5  DFE252010P-2R2M=P2  [INDC2520X100N]  11.94,6.55 90 top
L6  DFE252010P-2R2M=P2  [INDC2520X100N]  31.37,6.48 90 bottom
L7  DFE252010P-2R2M=P2  [INDC2520X100N]  22.35,4.06 180 bottom
LED1  BLUE  [0603-LED]  3.43,1.4 270 top
LED2  RED  [0603-LED]  3.43,5.33 270 top
LED3  BLUE  [0603-LED]  3.43,3.37 270 top
LED4  LTST-E263CEGBK  [LTST-E263CEGBK]  15.77,12.8 0 top
Q1  AO3415A  [SOT95P280X125-3N]  5.56,17.65 270 top
Q2  BCM856BS  [SOT65P210X110-6N]  4.13,21.08 0 bottom
Q3  9HT10-32.768KEZF-T  [3.2X1.5]  38.04,21.59 180 bottom
Q4  L2N7002WT1G  [SOT65P220X100-3N]  27.18,3.86 0 top
R1  30K ohm  [0402]  49.2,17.48 90 bottom
R2  30K ohm  [0402]  50.1,17.48 90 bottom
R3  10K ohm  [0402]  11.94,15.21 0 top
R4  30K ohm  [0402]  45.6,17.48 90 bottom
R5  30K ohm  [0402]  46.5,17.48 90 bottom
R6  10K ohm  [0402]  5.59,11.49 270 top
R7  30K ohm  [0402]  48.3,17.48 90 bottom
R8  100K ohm  [0402]  51,17.48 90 bottom
R9  22 ohm  [0402]  47.4,17.48 270 bottom
R10  100K ohm  [0402]  42.9,6.65 90 top
R11  100K ohm  [0402]  51.9,17.48 90 bottom
R12  10K ohm / 1%  [0402]  6.6,20.32 0 bottom
R13  10K ohm / 1%  [0402]  6.6,21.08 0 bottom
R14  6.8K ohm  [0402]  0.7,22.66 90 top
R15  10K ohm  [0402]  0.7,21.03 270 top
R16  2K ohm / 1%  [0402]  17.72,16.29 90 top
R17  2K ohm / 1%  [0402]  17.72,14.64 90 top
R18  100 ohm  [0402]  27.41,22.68 90 top
R19  10K ohm  [0402]  44.83,7.81 90 bottom
R20  10K ohm  [0402]  48.47,6.27 90 top
R21  10K ohm  [0402]  10.92,17.78 0 top
R22  10K ohm  [0402]  22.33,3.28 0 top
R23  10K ohm  [0402]  9.75,3.17 0 top
R24  10M ohm  [0402]  38.04,19.92 0 bottom
R25  6.8K ohm / 1%  [0402]  8.76,17.91 180 top
R26  47K ohm  [0402]  37,21.79 270 top
R27  240 ohm / 1%  [0402]  23.75,16.83 180 top
R28  240 ohm / 1%  [0402]  23.75,16.07 180 top
R29  10K ohm / 1%  [0402]  19.68,3.3 180 top
R30  10K ohm / 1%  [0402]  7.37,3.17 180 top
R31  10K ohm  [0402]  43.31,17.23 270 bottom
R32  30K ohm / 1%  [0402]  8.76,17.14 0 top
R33  100K ohm  [0402]  37.77,21.79 270 top
R34  15K ohm / 1%  [0402]  17.91,3.3 180 top
R35  10K ohm / 1%  [0402]  5.76,3.17 180 top
R37  1.5K ohm  [0402]  1.25,1.4 180 top
R38  10K ohm  [0402]  35.06,19.7 270 bottom
R39  33 ohm  [0402]  14.4,13.4 90 top
R40  10K ohm  [0402]  13.94,5.46 90 top
R41  1.5K ohm  [0402]  1.29,5.33 180 top
R42  1.5K ohm  [0402]  1.25,3.37 180 top
R43  240 ohm / 1%  [0402]  34.66,18.05 270 bottom
R44  6.8K ohm / 1%  [0402]  36.07,3.3 180 bottom
R45  30K ohm / 1%  [0402]  37.72,3.3 180 bottom
R46  12K ohm / 1%  [0402]  23.88,6.88 270 bottom
R47  10K ohm / 1%  [0402]  24.64,6.88 90 bottom
R48  30K ohm / 1%  [0402]  26.59,6.45 0 bottom
R49  1K ohm  [0402]  19.53,22.69 90 top
R50  10K ohm  [0402]  24.38,4.06 180 top
R51  0 ohm  [0402]  20.29,22.69 90 top
R52  10K ohm  [0402]  13.58,15.21 0 top
S1  KMR231GLFS  [TACTILE_SWITCH_SMD]  15.77,8.12 90 top
S2  KMR231GLFS  [TACTILE_SWITCH_SMD]  15.77,17.48 90 top
U1  AP6212  [AP6212]  47.4,14 180 top
U2  STM32F411CEU6TR  [UFQFPN-48]  49.23,9.12 180 bottom
U$1  [OSHW-LOGO-S]  43.18,20.7 0 bottom
X1  10118192-0001LF  [10118192-0001LF(MICRO-USB-B-AMPHENOL-FCI)]  1.45,12.8 270 top
Y1  26MHz  [4-SMD-2X1.6MM]  52.58,21.01 180 bottom
Y2  24MHz  [CRYSTAL-SMD-3.2X2.5MM-EPSON-TSX-3225]  41.65,11.64 270 bottom
Y3  CSTCW25M0X53-R0  [CSTCW25M0X53-R0]  43.69,-3.56 270 bottom
Z1  AVRL101A1R1NTB/NC  [0402-RES]  6.6,11.62 90 top
Z2  AVRL101A1R1NTB/NC  [0402-RES]  7.87,11.75 90 top
Z3  AVRL101A1R1NTB/NC  [0402-RES]  7.87,14.5 270 top
Z4  AVRL101A1R1NTB/NC  [0402-RES]  6.22,15.16 180 top

## Tracks (layer width: path | path; a pad name or v marks a point on that pad's centre or on a via)
1.2V  (via drill 0.2, 0.3)
  Top 0.102: v7.34,5.2 7.03,4.89 5.74,4.89 5.26,4.42 R35.2
  Top 0.305: IC2.J12 v33.48,11.38 | IC2.J10 v34.77,11.38 | IC2.K10 v34.77,12.03 | IC2.K11 v34.12,12.68 | IC2.K12 v33.48,12.03 | IC2.H10 v34.12,11.38 | IC2.L14 v32.17,12.68 | IC2.L13 v32.83,12.68 | IC2.L12 v33.48,13.32 | IC2.L11 v33.48,12.68 | IC2.F8 v35.42,10.07 | IC2.J11 v34.12,12.03 | IC2.L10 v34.77,12.68
  Bottom 0.305: C26.1 v33.47,13.33 v33.48,13.32 | v33.48,12.68 33.95,13.15 C20.1 | C19.1 34.84,11.96 v34.77,12.03 | C23.1 32.16,12.66 v32.17,12.68 | C29.1 34.77,10.93 v34.77,11.38
  other vias: 13.84,7.75 13.73,7.06
  pour Top (no thermals): 14.05,8.92 14.05,6.73 13.2,6.73 13.2,7.11 13.2,7.11 9.73,7.06 9.73,10.13 10.67,10.13 10.67,8.92
  pour PWR: 35,13.59 31.95,13.59 31.95,11.68 33.15,11.68 33.15,11.05 34.44,11.05 34.44,7.49 26.67,7.49 26.67,6.86 14.37,6.86 14.37,8.23 12.95,8.23 12.95,6.86 7.15,6.86 7.15,4.95 7.8,4.95 7.8,5.66 19.72,5.66 19.72,5.13 26.85,5.13 26.85,5.82 35.81,5.82 35.81,12.19 35.52,12.19 35,12.71
1.5V  (via drill 0.2)
  Top 0.102: C73.1 | C56.1 23.19,20.99 | v27.35,16.47 27.33,16.44 26.76,16.44 26.51,16.69 26.26,16.69 25.96,16.39 25.96,15.31 C52.1 | v26.3,11.38 25.93,11.38 25.59,11.04 25.37,11.04 25.01,10.68 C85.1 | v26.72,10.89 26.61,11 26.05,11 25.81,10.77 25.81,10.59 25.63,10.41 25.45,10.41 C84.1 | v25.59,16.31 25.11,15.83 24.82,15.83 C76.1 | 30.57,14.95 IC2.P16 | C81.1 25.08,9.65 | C63.1 24.07,9.65 | v29.57,14.68 29.61,14.62 30.23,14.62 IC2.N16 | R34.2 17.38,3.28 17.38,2.81 17.19,2.62 14.15,2.62 13.32,3.44 13.32,6.13 13.66,6.47 14.03,6.47 14.3,6.74 14.3,9.82 13.35,10.77 13.35,13.84 13.86,14.36 16.3,14.36 17.55,13.11 17.55,9.75 18.06,9.24 C57.1
  Top 0.305: IC2.M16 v30.88,13.97 | IC2.L16 v30.88,13.32 | v19.05,20.6 C73.1 | C55.1 18.76,18.71 v19.05,19 | C69.1 18.99,10.89 v19.1,11 | v19.05,13.4 18.54,13.4 18.48,13.46 C68.1 | C61.1 21.36,11.72 21.12,11.72 v20.8,11.4 | C75.1 20.34,9.46 v20,9.8 | v19.1,9.4 18.94,9.24 C57.1 | 23.19,20.99 24.36,20.99 24.64,20.71 26.41,20.71 v26.53,20.6 | C90.1 26.37,18.89 v26.49,19.01 | v25.64,13.07 25.54,13.07 24.97,12.5 C80.1 | v24.98,8.79 25.08,8.88 C81.1 | C83.1 23.25,13.94 v23.75,13.44 | v19.05,14.8 19.39,15.14 C92.1 | v20.02,17.08 19.73,16.79 C62.1 C37.1 R16.2 | IC2.P17 30.26,15.31 v30.29,15.31 | IC2.T14 31.85,16.26 v31.52,16.59 31.52,16.57 IC2.T15 | IC2.P16 | IC2.P16 v30.88,15.28 | 30.57,14.95 IC2.P16 | IC2.T12 33.15,16.3 v32.83,16.63 32.5,16.3 IC2.T13 | IC2.U11 33.93,17.03 34.32,17.03 v34.45,16.9 | IC2.R16 v30.2,15.95
  Top 0.406: C84.1 25.08,9.65 24.07,9.65
  Bottom 0.102: IC4.H9 26.4,15 26.58,14.81 26.99,14.81 27.35,15.18 v27.35,16.47 | IC4.D9 | C12.1 30.02,14.68
  Bottom 0.152: IC4.H2 20,14.6 19.25,14.6 v19.05,14.8
  Bottom 0.203: IC4.R1 v19.05,20.6 | v19.05,19 IC4.N1 | IC4.A1 v19.1,9.4 | IC4.B2 v20,9.8 | IC4.C1 v19.1,11 | IC4.D2 v20.8,11.4 | IC4.F1 v19.05,13.4 | IC4.A8 24.98,9.19 v24.98,8.79 | IC4.R9 v26.53,20.6 | IC4.C9 26.61,11 v26.72,10.89 | IC4.N9 26.01,19.01 v26.49,19.01 | IC4.G7 23.75,13.55 v23.75,13.44 | IC4.K8 25.3,16.6 v25.59,16.31 | IC4.E9 25.64,12.96 v25.64,13.07 | IC4.K2 20.4,16.7 v20.02,17.08
  Bottom 0.305: IC4.D9 26.3,11.51 v26.3,11.38 | C77.1 30.72,13.48 v30.88,13.32 | v30.2,15.95 30.27,16.02 C9.1 | 30.02,14.68 v29.57,14.68 | v34.45,16.9 34.3,17.05 34.25,17.05 33.95,17.34 C11.1 | v32.83,16.63 32.7,16.75 C6.1
  other vias: 22.3,8.51 22.78,8.51 23.27,8.51
  pour Top (no thermals): 21.97,8.89 21.97,6.88 25.4,6.88 25.4,7.14 26.52,7.14 26.52,8.05 23.62,8.05 23.62,8.89
  pour PWR (rank 2): 30.73,20.83 30.73,18.54 31.5,17.78 34.7,17.78 34.7,16.38 31.24,16.38 31.24,16.89 30.48,16.89 30.48,15.75 31.11,15.75 31.11,13.21 30.86,12.95 29.97,12.95 29.97,10.54 25.27,10.54 25.27,8.74 24.77,8.23 20.32,8.23 20.32,8.76 18.41,8.76 18.41,16.18 16.76,16.18 16.76,21 21.93,21 21.93,19.05 24.77,19.05 24.77,20.45 26.16,20.45 26.16,20.83
3.3V  (via drill 0.2, 0.3)
  Top 0.152: v6.22,5.23 6.12,5.33 LED2.A
  Top 0.305: IC2.G11 v34.12,10.07 IC2.G10 | v36.73,10.07 IC2.G7 36.4,10.41 v36.09,10.72 36.4,11.04 IC2.H7 | IC2.J15 v31.52,11.38 | IC2.H13 v32.83,10.72 | IC2.G13 v32.17,10.07 | IC2.G14 v32.17,10.72 IC2.H14 | IC2.G15 v31.52,10.72 | IC2.N3 38.35,14.95 v38.35,15.28 | IC2.V3 v39.33,17.88 | v32.17,11.38 IC2.J14 | IC2.G9 IC2.G10 | IC2.K6 v37.38,12.03 IC2.J6 | IC2.G10 34.44,10.4 v34.14,10.7 | v5.56,10.46 5.56,10.97 R6.2 | v10.21,4.29 10.21,3.22 R23.2 | R26.1 R33.1 38.1,22.29 38.45,21.94 v38.45,20.91 | U1.22 | v13.08,15.85 R52.1 | R40.1 v14.48,4.96
  Top 0.406: R3.2 R52.1
  Top 0.508: U1.9 52.2,16.7 v51.82,16.32 | U1.22 42.9,18.65 v42.75,18.5
  SIG1_RAM 0.61: v34.14,10.7 34.16,10.72 v36.09,10.72 38.11,10.72 | v39.32,10.1 38.69,10.72 38.11,10.72 | v39.38,12.68 38.66,12.68 38.11,12.13 38.11,10.72
  PWR 0.305: v36.09,10.72 37,10.72 37.38,11.1 v37.38,12.03
  SIG2_RAM 0.152: v22.86,2.69 17,2.69 16.62,2.31 14.46,2.31 14.21,2.55 10.91,2.55 9.91,3.56 7.9,3.56 v6.22,5.23
  Bottom 0.102: IC1.K9 IC1.J10 8.52,14.21 8.97,14.66 v9.78,14.66 | IC1.F5 IC1.E6 11.05,12.05 | 11.05,12.05 IC1.C6 | IC1.M4 IC1.N4 IC1.P3 6,10.57 | IC1.P5 5.72,11.25 5.72,10.85 6,10.57 | v11.05,12.32 11.05,12.05 | v5.56,10.46 5.89,10.46 6,10.57
  Bottom 0.305: 51.82,16.98 R11.1 | C35.1 34.19,9.39 34.19,9.9 34.12,9.96 v34.12,10.07 | C54.1 39.13,15.02 38.87,15.28 v38.35,15.28 | C33.1 32.83,10.24 v32.83,10.72 | v39.33,17.88 39.33,18.13 38.92,18.53 | C108.1 37.08,9.85 36.85,10.07 v36.73,10.07 | C10.1 30.3,10.54 30.55,10.79 31.45,10.79 v31.52,10.72 | C74.1 35.54,21.14 v35.77,20.91 | C1.2 v44.32,16.13 | C8.1 38.43,12.68 v39.38,12.68 | C13.1 31.89,9.79 v32.17,10.07
  Bottom 0.406: R5.1 R4.1 45.22,16.98 44.97,16.73 C1.2 | R7.1 R1.1 R2.1 R8.1 51.82,16.98 | 43.31,18.49 C30.1
  Bottom 0.508: v42.75,18.5 C30.1 | R31.1 43.31,18.49 | C34.1 51.65,16.15 v51.82,16.32 51.9,16.41 R11.1
  other vias: 30.59,8.46 31.77,8.46 38.73,3.05 39.24,3.05
  pour PWR (rank 3): -3,-3 50.93,-3 50.93,5.59 58,5.59 58,29.6 -3,29.6
  pour Bottom (no thermals): 30.3,6.99 33.78,6.99 33.78,8.41 32.26,8.41 32.26,9.14 30.3,9.14
  pour Bottom (no thermals): 41.91,3.81 38.02,3.81 38.02,2.74 41.91,2.74
  pour Top: 22.63,2.46 24.08,2.46 24.08,4.32 22.63,4.32
  pour Bottom (no thermals): 30.3,19.91 31.24,19.91 31.24,20.95 32.44,20.95 32.44,22.48 34.98,22.48 34.98,20.73 34.8,20.73 34.8,19.99 35.41,19.99 35.41,23.01 31.8,23.01 31.8,21.51 30.3,21.51
A0
  Bottom 0.102: U2.19 49.48,13.14 48.01,14.61 44.2,14.61 43.94,14.86 43.94,15.29 42.33,16.9 42.33,19.57 43.76,21 46.22,21 49.09,23.87 JP3.1
A1
  Bottom 0.102: U2.18 48.98,13.13 47.7,14.4 44.11,14.4 43.74,14.78 43.74,15.2 42.13,16.82 42.13,19.85 43.6,21.33 44.36,21.33 46.55,23.52 JP3.2
A2
  Bottom 0.102: U2.17 48.48,13.12 47.4,14.2 44.03,14.2 43.54,14.69 43.54,15.12 41.92,16.73 41.92,20.12 44.01,22.21 JP3.3
A3
  Bottom 0.102: U2.16 47.98,13.08 47.06,13.99 43.94,13.99 43.33,14.61 43.33,15.04 41.72,16.65 41.72,22.59 41.47,22.84 JP3.4
A4
  Bottom 0.102: U2.15 47.48,13.04 46.72,13.79 43.86,13.79 43.13,14.52 43.13,14.95 41.52,16.56 41.52,22.33 39.62,24.23 JP3.5
A5
  Bottom 0.102: U2.14 46.98,13 46.39,13.59 43.77,13.59 42.93,14.44 42.93,14.87 41.31,16.48 41.31,22.05 40.21,23.16 37.46,23.16 JP3.6
A6
  Bottom 0.102: U2.13 46.48,13.02 46.11,13.39 43.69,13.39 42.72,14.35 42.72,14.75 41.11,16.36 41.11,21.8 39.96,22.95 35.99,22.95 35.43,23.51 34.57,23.51 JP3.7
A7
  Bottom 0.102: U2.12 45.85,12.7 45.36,13.18 43.61,13.18 42.52,14.27 42.52,14.67 40.88,16.31 40.88,21.62 39.75,22.75 35.86,22.75 35.56,23.05 32.49,23.05 JP3.8
A8  (via drill 0.2)
  SIG2_RAM 0.102: JP3.9 29.95,23.05 36.26,23.05 37.69,21.61 37.69,13.86 38.16,13.4 43.39,13.4 v44.16,12.62
  Bottom 0.102: U2.11 45.57,11.37 44.33,12.62 v44.16,12.62
A9  (via drill 0.2)
  SIG2_RAM 0.102: JP3.10 28.16,22.3 29.17,22.3 29.4,22.07 36.09,22.07 37.01,21.16 37.01,19.08 37.49,18.6 37.49,13.78 38.07,13.2 42.73,13.2 v43.73,12.19
  Bottom 0.102: U2.10 45.53,10.87 44.22,12.19 v43.73,12.19
AP_RESET#  (via drill 0.2)
  Top 0.102: v36.08,19.18 36.08,18.35 36.88,17.55 IC2.V6
  Bottom 0.102: IC8.2 34.22,19.25 C89.1 R38.2 36.05,19.2 v36.08,19.18
B0  (via drill 0.2)
  SIG2_RAM 0.102: v53.12,8.39 53.23,8.28 53.24,8.28 53.43,8.09 53.43,7.07 50.81,4.46 50.81,3.09 JP2.18
  Bottom 0.102: U2.32 52.62,8.39 v53.12,8.39
B1  (via drill 0.2)
  SIG2_RAM 0.102: JP2.17 47.39,2.21 47.81,2.21 53.11,7.51 v53.11,7.96
  Bottom 0.102: U2.33 52.69,7.96 v53.11,7.96
B2  (via drill 0.2)
  Top 0.102: JP2.16 44.01,2.15 v46.1,4.24
  SIG2_RAM 0.102: v54.52,11.96 50.01,11.96 46.1,8.05 v46.1,4.24
  Bottom 0.102: U2.28 52.94,10.37 v54.52,11.96
B3  (via drill 0.2)
  Top 0.102: JP2.15 41.47,2.1 42.27,2.9 44.25,2.9 v45.59,4.24
  SIG2_RAM 0.102: v45.59,4.24 45.58,4.26 45.58,8.11 49.93,12.46 v54.52,12.46
  Bottom 0.102: U2.27 52.93,10.87 v54.52,12.46
B4  (via drill 0.2)
  Top 0.102: JP2.14 38.93,1.9 40.13,3.1 43.56,3.1 v44.7,4.24
  SIG2_RAM 0.102: v54.52,12.97 54.38,12.83 49.78,12.83 44.7,7.75 v44.7,4.24
  Bottom 0.114: U2.26 52.92,11.37 v54.52,12.97
B5  (via drill 0.2)
  Top 0.102: JP2.13 37.43,2.41 39.15,2.41 40.04,3.3 43.26,3.3 v44.2,4.24
  SIG2_RAM 0.102: v44.2,4.24 44.2,7.87 49.8,13.47 v54.51,13.47 v54.52,13.48
  Bottom 0.102: v54.52,13.48 52.91,11.87 U2.25
BOOT0  (via drill 0.2)
  Top 0.102: IC2.C3 39.35,7.45 39.35,7.03 39.52,6.85 40.62,6.85 41.63,5.84 41.63,4.95 v42.27,4.32
  Top 0.152: v48.48,5.08 48.47,5.09 R20.1
  Bottom 0.102: v48.48,5.08 48.48,5.05 48.06,4.64 44.14,4.64 43.81,4.32 v42.27,4.32
  Bottom 0.152: U2.44 v48.48,5.08
C0  (via drill 0.2)
  Top 0.102: JP2.12 34.23,1.37 35.48,2.62 37.77,2.62 38.66,3.5 42.95,3.5 43.69,4.24 v43.69,4.67
  Bottom 0.102: U2.45 47.98,5.15 47.7,4.88 43.89,4.88 v43.69,4.67
C1  (via drill 0.2)
  SIG2_RAM 0.102: v46.61,4.24 46.61,8 49.59,10.98 54.06,10.98 v54.52,11.45
  Bottom 0.102: JP2.11 32.48,2.54 44.91,2.54 v46.61,4.24 | U2.29 52.95,9.87 v54.52,11.45
C2  (via drill 0.2)
  Top 0.102: JP2.10 28.77,1.39 29.79,2.41 34.98,2.41 35.39,2.82 37.69,2.82 38.58,3.71 42.8,3.71 43.31,4.22 v43.31,4.99
  Bottom 0.102: U2.46 47.48,5.31 47.28,5.12 43.43,5.12 v43.31,4.99
C3  (via drill 0.2)
  Top 0.102: JP2.9 26.81,1.37 27.86,2.41 29.25,2.41 29.45,2.62 34.9,2.62 35.31,3.02 37.6,3.02 38.49,3.91 42.52,3.91 42.94,4.33 42.94,5.15 45.14,7.34 45.14,10.85 47.45,13.16 v50.48,13.16
  Bottom 0.127: U2.21 v50.48,13.16
C4  (via drill 0.2)
  SIG2_RAM 0.102: v47.07,3.15 47.47,3.56 47.9,3.56 48.18,3.28 48.18,2.87 47.73,2.41 24.73,2.41 JP2.8
  Bottom 0.102: U2.43 48.98,5.03 47.09,3.15 v47.07,3.15
C5  (via drill 0.2)
  SIG2_RAM 0.102: JP2.7 22.16,2.38 24.01,2.38 24.25,2.62 47.24,2.62 v47.78,3.15
  Bottom 0.102: U2.42 49.48,5.12 47.78,3.42 v47.78,3.15
CPUX_VSET
  Top 0.102: 25.84,4.51 25.39,4.06 R50.1 24.88,2.93 25.22,2.59 27.41,2.59 27.64,2.82 28.51,2.82 30.55,4.87 IC2.A16
  Top 0.406: 25.84,4.51 Q4.1
D0  (via drill 0.2)
  SIG1_RAM 0.102: JP2.6 20.72,3.48 28.61,3.48 29.73,2.35 39.28,2.35 40.18,3.25 45.87,3.25 v45.97,3.15
  Bottom 0.102: U2.41 49.98,5.26 48.75,4.04 48.75,3.37 48.17,2.79 46.33,2.79 v45.97,3.15
D1  (via drill 0.2)
  SIG1_RAM 0.102: v49,2.95 48.47,3.47 40.11,3.47 39.2,2.56 29.82,2.56 28.69,3.68 18.41,3.68 16.1,1.37 JP2.5
  Bottom 0.102: U2.40 50.48,5.31 49.2,4.04 49.2,3.15 v49,2.95
D2  (via drill 0.2)
  SIG1_RAM 0.102: JP2.4 13.53,3.12 14.43,4.01 32.21,4.01 32.83,3.39 33.46,3.39 33.76,3.69 49.21,3.69 v49.55,3.35
  Bottom 0.102: U2.39 50.98,5.35 49.55,3.93 v49.55,3.35
D3  (via drill 0.2)
  SIG1_RAM 0.102: JP2.3 13.86,4.23 30.86,4.23 31.76,5.13 34.08,5.13 35.31,3.9 49.98,3.9 v50.11,3.76
  Bottom 0.102: U2.38 51.48,5.46 50.86,4.85 50.8,4.85 50.11,4.17 v50.11,3.76
D4  (via drill 0.2)
  SIG1_RAM 0.102: JP2.2 9.25,2.17 9.59,2.17 11.85,4.43 30.78,4.43 31.69,5.34 48.29,5.34 48.34,5.4 49.11,5.4 v50.49,4.01
  Bottom 0.102: v50.49,4.01 50.49,4.26 50.88,4.65 51.13,4.65 51.98,5.49 U2.37
D5  (via drill 0.2)
  Top 0.152: LED1.A 5.88,1.4 JP2.1
  SIG1_RAM 0.102: JP2.1 6.01,1.37 8.44,3.81 8.44,3.9 10.52,5.98 27.08,5.98 27.25,5.81 27.74,5.81 27.78,5.84 31.33,5.84 31.58,5.59 44.54,5.59 45.06,6.11 52.47,6.11 53.43,7.08 53.43,8.67 v53.34,8.76
  Bottom 0.102: v53.34,8.76 53.44,8.66 53.44,7.74 53.07,7.37 U2.34
EMMC_CLK  (via drill 0.2)
  Top 0.102: v29.44,6.17 29.57,6.17 IC2.A17
  SIG2_RAM 0.102: v29.44,6.17 29,5.73 29,5.3 28.8,5.11 26.55,5.11 25.44,6.21 17.48,6.21 17.19,6.5 12.55,6.5 10.61,8.44 10.61,9.4 arc-90 10.78,9.58 11.88,9.58 arc90 12.06,9.75 12.06,9.91 arc90 11.88,10.09 10.78,10.09 arc-90 10.61,10.27 10.61,10.43 arc-90 10.78,10.61 11.88,10.61 arc90 12.06,10.78 12.06,10.94 arc90 11.88,11.12 10.78,11.12 arc-90 10.61,11.3 10.61,12.48 11.49,13.36 11.49,14.29 11.18,14.61 v11.05,14.61
  Bottom 0.102: v11.05,14.61 11.05,15.57 10.6,16.02 8.48,16.02 7.02,14.57 IC1.M6
EMMC_CMD  (via drill 0.2)
  Top 0.102: IC2.E16 30.57,9.1 v30.87,8.79 | v10.91,14.19 10.93,14.16 11.18,14.16 11.44,14.42 R3.1
  SIG2_RAM 0.102: v30.87,8.79 30.9,8.76 30.9,7.49 30.46,7.05 30.46,5.62 29.56,4.72 29.45,4.72 29.43,4.7 26,4.7 24.97,5.73 17.15,5.73 16.97,5.92 12.18,5.92 10.2,7.89 10.2,13.48 v10.91,14.19
  Bottom 0.102: IC1.M5 7.08,11.55 7.35,11.82 7.35,14.38 8.54,15.57 10.04,15.57 10.53,15.07 10.53,14.57 v10.91,14.19
EMMC_D0  (via drill 0.2)
  Top 0.102: v27.62,7.42 27.7,7.5 28.84,7.5 29.18,7.15 IC2.B18
  SIG2_RAM 0.102: v27.62,7.42 27.62,7.32 27.14,6.83 26.54,6.83 26.27,7.11 18.88,7.11 18.2,7.79 arc90 17.95,7.79 17.8,7.63 arc-90 17.55,7.63 17.53,7.66 arc-90 17.53,7.91 17.68,8.06 arc90 17.68,8.31 17.66,8.33 arc90 17.41,8.33 17.25,8.18 arc-90 17,8.18 16.98,8.2 arc-90 16.98,8.45 17.14,8.6 arc90 17.14,8.85 17.11,8.87 arc90 16.86,8.87 16.71,8.72 arc-90 16.46,8.72 16.44,8.74 arc-90 16.44,8.99 16.59,9.14 arc90 16.59,9.39 16.57,9.41 arc90 16.32,9.41 16.17,9.26 arc-90 15.92,9.26 15.9,9.28 arc-90 15.9,9.53 16.05,9.68 arc90 16.05,9.94 16.03,9.96 arc90 15.78,9.96 15.63,9.8 arc-90 15.38,9.8 15.36,9.82 arc-90 15.36,10.08 15.51,10.23 arc90 15.51,10.48 15.44,10.55 v14.1,10.55
  Bottom 0.102: v14.1,10.55 IC1.A3
EMMC_D1  (via drill 0.2)
  Top 0.102: v28.92,8.78 v28.92,8.77 28.92,7.7 29.12,7.5 29.6,7.5 IC2.C17 | IC2.C17
  SIG2_RAM 0.102: 28.8,7.95 arc-90 28.8,7.7 28.78,7.67 arc-90 28.52,7.67 28.07,8.12 arc90 27.82,8.12 27.24,7.54 27.24,7.22 27.05,7.04 26.67,7.04 26.39,7.32 18.98,7.32 15.24,11.05 v13.03,11.05 | v28.92,8.78 28.5,8.78 arc45 28.46,8.76 28.35,8.65 arc90 28.35,8.4 28.8,7.95 | 28.8,7.95
  Bottom 0.102: IC1.A4 v13.03,11.05
EMMC_D2  (via drill 0.2)
  Top 0.102: IC2.D17 29.86,8.45 v29.59,8.72
  SIG2_RAM 0.102: v29.59,8.72 29.22,9.09 28.43,9.09 27.01,7.67 26.79,7.67 26.64,7.52 19.14,7.52 18.85,7.8 arc-90 18.85,8.06 18.88,8.09 arc90 18.88,8.34 18.88,8.34 arc90 18.63,8.34 18.6,8.31 arc-90 18.35,8.31 18.34,8.31 arc-90 18.34,8.56 18.37,8.6 arc90 18.37,8.85 18.37,8.85 arc90 18.12,8.85 18.09,8.82 arc-90 17.84,8.82 17.83,8.82 arc-90 17.83,9.07 17.86,9.11 arc90 17.86,9.36 17.86,9.36 arc90 17.61,9.36 17.58,9.33 arc-90 17.33,9.33 17.32,9.33 arc-90 17.32,9.59 17.35,9.62 arc90 17.35,9.87 17.35,9.87 arc90 17.1,9.87 17.07,9.84 arc-90 16.82,9.84 16.81,9.84 arc-90 16.81,10.09 16.84,10.12 arc90 16.84,10.38 16.84,10.38 arc90 16.59,10.38 16.56,10.35 arc-90 16.31,10.35 16.3,10.35 arc-90 16.3,10.6 16.34,10.63 arc90 16.34,10.88 16.33,10.89 arc90 16.08,10.89 16.05,10.86 arc-90 15.8,10.86 15.36,11.3 14.22,11.3 v13.97,11.55
  Bottom 0.102: IC1.A5 v13.97,11.55
EMMC_D3  (via drill 0.2)
  Top 0.102: IC2.C18 v29.25,8.45
  SIG2_RAM 0.102: v29.25,8.45 29.2,8.39 29.2,7.9 30,7.1 30,6.7 29.79,6.49 29.34,6.49 28.64,7.19 28.15,7.19 27.39,6.43 26.35,6.43 26.1,6.68 17.86,6.68 17.48,7.07 16.32,7.07 v13.97,9.41
  Bottom 0.102: IC1.B2 12.66,9.41 v13.97,9.41
EMMC_D4  (via drill 0.2)
  Top 0.102: IC2.B17 29.86,7.15 v29.55,6.84
  SIG2_RAM 0.102: v29.55,6.84 29.01,7.39 28.07,7.39 27.31,6.63 26.44,6.63 26.16,6.9 17.99,6.9 17.59,7.3 16.62,7.3 16.53,7.39 arc-90 16.53,7.64 16.57,7.68 arc90 16.57,7.93 16.56,7.94 arc90 16.31,7.94 16.27,7.9 arc-90 16.02,7.9 16.01,7.91 arc-90 16.01,8.17 16.04,8.2 arc90 16.04,8.46 16.03,8.47 arc90 15.78,8.47 15.74,8.43 arc-90 15.49,8.43 15.48,8.44 arc-90 15.48,8.69 15.52,8.73 arc90 15.52,8.98 15.51,8.99 arc90 15.26,8.99 15.22,8.96 arc-90 14.96,8.96 14.95,8.97 arc-90 14.95,9.22 14.99,9.26 arc90 14.99,9.51 14.98,9.52 arc90 14.73,9.52 14.69,9.48 arc-90 14.44,9.48 14.43,9.49 arc-90 14.43,9.74 14.47,9.78 arc90 14.47,10.03 14.45,10.05 arc90 14.2,10.05 14.16,10.01 arc-90 13.91,10.01 13.69,10.23 v13.27,10.23
  Bottom 0.102: IC1.B3 12.54,10.03 12.95,10.03 13.14,10.23 v13.27,10.23
EMMC_D5  (via drill 0.2)
  Top 0.102: v28.28,6.87 28.56,7.15 IC2.B19
  SIG2_RAM 0.102: v28.28,6.87 28.28,6.23 27.86,5.8 27.26,5.8 26.84,6.21 26.28,6.21 26.02,6.48 17.78,6.48 17.4,6.86 15.37,6.86 14.99,7.24 arc-90 14.99,7.49 15.02,7.53 arc90 15.02,7.78 14.97,7.83 arc90 14.72,7.83 14.69,7.79 arc-90 14.43,7.79 13.84,8.38 v13.41,8.38
  Bottom 0.102: IC1.B4 11.05,10.08 11.05,8.76 11.43,8.38 v13.41,8.38
EMMC_D6  (via drill 0.2)
  Top 0.102: IC2.F17 29.8,9.65 29.78,9.65 29.53,9.4 27.82,9.4 27.62,9.2 v27.62,8.77
  SIG2_RAM 0.102: v27.62,8.77 v27.63,8.77 27.63,8.57 26.93,7.88 26.68,7.88 26.52,7.72 19.81,7.72 15.94,11.6 14.52,11.6 14.24,11.87 13.58,11.87 13.26,11.55 v11.03,11.55
  Bottom 0.102: v11.03,11.55 IC1.B5
EMMC_D7  (via drill 0.2)
  Top 0.102: IC2.C19 28.26,8.14 27.49,8.14 27.34,8.29 v26.89,8.29
  SIG2_RAM 0.102: v26.89,8.29 26.64,8.29 26.28,7.93 19.94,7.93 18.57,9.3 arc-90 18.57,9.55 18.69,9.67 arc90 18.69,9.92 18.64,9.96 arc90 18.39,9.96 18.28,9.85 arc-90 18.03,9.85 17.98,9.89 arc-90 17.98,10.14 18.1,10.25 arc90 18.1,10.51 18.05,10.55 arc90 17.8,10.55 17.69,10.43 arc-90 17.44,10.43 17.4,10.48 arc-90 17.4,10.73 17.51,10.84 arc90 17.51,11.09 17.47,11.14 arc90 17.22,11.14 17.1,11.02 arc-90 16.85,11.02 16.81,11.06 arc-90 16.81,11.31 16.92,11.43 arc90 16.92,11.68 16.88,11.72 arc90 16.63,11.72 16.51,11.61 arc-90 16.26,11.61 16,11.87 14.54,11.87 14.3,12.1 13.65,12.1 13.28,12.47 13.28,12.83 v13.03,13.08
  Bottom 0.102: IC1.B6 12.02,12.56 12.54,13.08 v13.03,13.08
EMMC_RST  (via drill 0.2)
  Top 0.102: v30.26,8.74 30.26,8.96 30.25,8.97 30.25,9.22 30.43,9.4 30.63,9.4 30.85,9.62 30.85,9.91 30.7,10.06 30.65,10.06 30.44,10.27 30.44,10.84 30.55,10.95 IC2.H16
  SIG2_RAM 0.102: v30.26,8.74 30.26,5.7 29.48,4.92 29.36,4.92 29.34,4.91 26.09,4.91 25.05,5.94 17.26,5.94 17.03,6.17 12.21,6.17 10.4,7.98 10.4,13.1 v11.05,13.75
  Bottom 0.102: IC1.K5 7.95,11.55 7.66,11.84 7.66,14.21 8.48,15.03 9.94,15.03 10.19,14.78 10.19,14.4 10.84,13.75 v11.05,13.75
GND  (via drill 0.2, 0.25, 0.3, 0.35)  (1 unrouted)
  Top 0.102: C73.2 | C57.2 18.52,10.2 | v22.61,13.68 22.34,13.95 22.34,14.71 22.89,15.26 C76.2 | 26.07,9.33 C81.2 | v17.16,14.14 v17.15,14.15 | v23.7,20 23.68,19.98 | 42.88,6.17 R10.1
  Top 0.107: 12.03,17.78 v12.06,17.78
  Top 0.152: C56.2 23.8,22.58 24.96,21.41 v26.45,21.41 | v26.66,13.44 26.64,13.41 25.59,13.41 25.25,13.76 25.25,15.02 C52.2
  Top 0.305: IC2.R14 31.72,15.73 31.33,15.73 v31.2,15.6 | IC2.R13 32.48,15.6 v32.17,15.9 | IC2.R12 33.12,15.6 v32.83,15.9 | v34.77,15.9 34.48,15.6 IC2.R10 | IC2.R9 v35.42,15.93 IC2.T9 | IC2.P13 v32.83,15.28 | IC2.P12 v33.48,15.28 | IC2.P11 v34.12,15.28 | IC2.P10 v34.77,15.28 | IC2.N9 v35.42,14.62 | IC2.P14 v32.17,15.28 | IC2.N14 v32.17,14.62 | IC2.N13 v32.83,14.62 | IC2.N12 v33.48,14.62 | IC2.N11 v34.12,14.62 | IC2.N10 v34.77,14.62 | IC2.M9 v35.42,13.97 | IC2.M8 v36.08,13.97 | IC2.N7 v36.73,13.97 | IC2.L9 v35.42,13.32 | IC2.L8 v36.08,13.32 | IC2.K9 v35.42,12.68 | IC2.K8 v36.08,12.68 | IC2.G8 v36.08,10.07 | IC2.U3 v39.33,16.57 | IC2.M5 v38.02,13.97 | IC2.M14 v32.17,13.97 | IC2.M13 v32.83,13.97 | IC2.M12 v33.48,13.97 | IC2.M11 v34.12,13.97 | IC2.M10 v34.77,13.97 | IC2.N15 v31.52,14.62 | IC2.M15 v31.52,13.97 | IC2.L15 v31.52,13.32 | IC2.K16 v30.23,12.03 | IC2.K14 v31.52,12.68 | IC2.K13 v32.83,12.03 | IC2.J16 v30.88,11.38 | IC2.H15 30.77,10.62 v30.77,10.38 v30.78,10.38 | IC2.J13 v32.83,11.38 IC2.H12 | v19.05,21.48 18.3,22.23 18.3,22.3 C73.2 | v19.05,19.8 18.37,19.8 C55.2 | 18.52,10.2 v19.1,10.2 | C69.2 19.01,11.89 v19.1,11.8 | C68.2 19.01,12.51 v19.1,12.6 | v20,12.2 20.63,12.83 C61.2 | C90.2 26.32,19.89 v26.46,19.75 | v26.35,13.14 26.1,12.89 26.1,12.47 C80.2 | v26.07,8.79 26.07,9.33 26.45,9.33 v26.57,9.21 | C85.2 25.4,11.68 v25.59,11.49 | v24.79,14.49 24.76,14.46 C83.2 | v17.16,14.14 R17.1 C38.2 | C62.2 19.66,15.79 v20,16.13 | 23.68,19.98 C51.2 | R27.2 R28.2 23.19,16 21.7,16 v21.5,16.21 | v31.52,15.28 IC2.P15 | v30.88,12.68 IC2.K15 | IC2.R11 33.77,15.6 v33.48,15.9 | v34.12,15.9 33.8,16.23 IC2.T11 | IC2.H8 v35.42,11.38 IC2.J9 | IC2.K7 v36.73,12.68 | IC2.M7 v36.73,13.32 | C79.2 v50.96,6.64 v50.97,6.65
  Top 0.305: v19.05,14.28 19.23,14.28 19.36,14.14 C92.2 | C63.2 22.17,9.82 21.62,9.82 v21.6,9.8 21.34,9.54 C75.2 21.34,9.05 20.97,8.68 20.97,7.72 C65.2 20.45,7.79 v20.45,8.51 v20.93,8.51 | 42.88,6.17 v42.24,6.17 | v13.46,9.73 13.44,9.72 C78.2 | S1.3 16.55,5.86 15.79,5.1 C41.2 | C81.2 C84.2 | IC2.AA1 v39.98,19.18 | v40.56,19.19 40.65,19.19 40.82,19.36 40.82,20.26 C25.2 | R21.2 12.03,17.78
  Top 0.406: U1.33 41.24,9.5 40.89,9.16 v40.89,8.39 | U1.3 v51.71,11.3 | U1.1 v51.71,9.5 | S1.3 S1.4 16.55,11.13 C99.2 16.29,11.43 LED4.4 v16.94,12.28 | S2.3 S2.4 | C64.2 18.03,22.23 C73.2 | C86.2 C70.2 v47.88,6.77 R20.2 | U1.36 44.7,9 v44.41,9.28 | v43.03,11.49 42.85,11.3 U1.31 | C7.1 C3.1 12.14,9.72 C78.2
  Top 0.508: U1.20 44.7,18.63 v44.83,18.5
  GND1 0.508: JP3.15 13.53,23.17 | JP3.15 12.47,24.23 | JP3.15 13.53,25.04 | JP3.14 16.07,23.18 | JP3.14 16.07,25.03 | JP3.14 16.1,24.26 17.14,24.26 | JP3.14 JP3.15
  GND2 0.508: JP3.15 13.53,23.17 | JP3.15 12.47,24.23 | JP3.15 13.53,25.04 | JP3.14 16.07,23.18 | JP3.14 16.07,25.03 | JP3.14 16.1,24.26 17.14,24.26 | JP3.14 JP3.15
  GND3 0.508: JP3.15 13.53,23.17 | JP3.15 12.47,24.23 | JP3.15 13.53,25.04 | JP3.14 16.07,23.18 | JP3.14 16.07,25.03 | JP3.14 16.1,24.26 17.14,24.26 | JP3.14 JP3.15
  Bottom 0.102: IC4.J8 25.2,15.75 24.77,15.33 24.77,14.85 24.55,14.63 24.25,14.63 23.44,13.81 22.74,13.81 v22.61,13.68 | IC4.G9 26.09,14.11 26.44,14.11 26.66,13.88 v26.66,13.44 | 50.88,20.43 C15.1 | Y1.2 53.38,21.51 | 6.02,11.1 IC1.P4 6.44,11.47 | 8.02,13.13 IC1.K8 8.02,13.01 8.52,12.51 8.52,11.94 | 8.94,14.05 IC1.H10 9.02,13.97 9.58,13.41 | IC1.E7 10.44,12.55 9.58,13.41 | IC1.G5 9.52,11.8 9.53,11.81 9.53,13.41 | IC1.G5 9.52,11.42 9.27,11.18 8.89,11.18 | 8.89,11.18 8.77,11.18 8.52,11.42 IC1.J5 8.52,11.94 | 6.44,11.47 IC1.N5 | 6.44,11.47 6.44,11.63 IC1.P6 4.21,12.05 | IC1.C4 9.95,11.05 9.52,11.47 IC1.G5 | IC1.A6 13,12.05 v13.03,12.02 | v8.79,11.94 8.52,11.94 | IC1.N2 6.52,9.1 v6.99,8.64 | v9.83,13.41 9.58,13.41 | 8.89,11.18 8.87,11.15 v8.87,11.02
  Bottom 0.152: IC4.E8 24.8,12.2 24.12,12.2 v23.48,12.84 v23.48,12.85
  Bottom 0.203: IC4.T1 19.52,21.48 v19.05,21.48 | v19.05,19.8 IC4.P1 | IC4.B3 v21.6,9.8 | IC4.B1 v19.1,10.2 | IC4.E1 v19.1,12.6 | IC4.D1 v19.1,11.8 | IC4.E2 v20,12.2 | v18.9,18.24 18.94,18.2 IC4.M1 | v26.45,21.41 IC4.T9 | v26.46,19.75 26.05,19.75 IC4.P9 | IC4.G8 24.91,14.49 v24.79,14.49 | IC4.M9 26.7,18.2 v26.81,18.09 | IC4.F9 26.26,13.14 v26.35,13.14 | IC4.D8 25.51,11.49 v25.59,11.49 | IC4.A9 26,8.86 v26.07,8.79 | IC4.B9 26.57,9.63 v26.57,9.21 | IC4.J2 20.33,15.8 v20,16.13 | IC4.G1 19.13,14.2 v19.05,14.28
  Bottom 0.305: v44.83,18.5 C30.2 | Y1.4 50.88,20.43 | 53.38,21.51 C14.1 v54.36,22.1 | C53.2 38.07,13.93 v38.02,13.97 38.13,14.08 C54.2 | C24.2 36.74,13.34 v36.73,13.32 | C31.2 C107.2 35.45,18.52 v35.43,18.54 35.32,18.43 35.32,18.48 35.26,18.55 R43.1 | v38.02,15.93 37.84,16.11 C28.2 | v38.02,16.57 38.08,16.63 C21.2 | v36.73,12.68 37.29,12.68 C8.2 | v30.23,12.03 30.23,12.45 C77.2 | C26.2 v31.52,13.32 | v35.42,13.32 C20.2 | C9.2 31.83,15.9 v32.17,15.9 32.1,15.97 32.1,16.62 31.7,17.03 C6.2 31.7,17.49 32,17.79 C104.2 | C12.2 31.46,14.69 v31.52,14.62 | 35.43,9.21 35.8,9.21 C108.2 v36.08,10.07 | 35.43,9.21 C35.2 | C4.2 C2.2 v38.73,11.38 | v36.08,12.68 36.2,12.55 C19.2 | v30.78,10.38 30.89,10.26 C13.2 | v30.88,12.68 31.16,12.39 C23.2 | v30.88,11.38 30.71,11.54 C10.2 | v32.84,8.71 32.77,8.78 C33.2 C60.2 33.53,8.9 v33.35,8.71 | v33.48,15.9 33.48,16.33 C11.2 | v39.98,19.18 40.15,19.35 C50.2 | C49.2 v35.93,20.45 | Y2.2 42.87,10.95 42.87,11.32 v43.03,11.49 | C15.1 50.24,20.51 v50.09,20.66 | U2.47 46.98,6.75 49.23,9 U2.49 | U2.49 49.23,8.12 v47.88,6.77 | v50.97,6.65 51.19,6.87 U2.35 | U2.49 49.98,9.87 U2.20 49.98,13.79 C39.2 C34.2 49.58,14.94 v49.15,14.94 | U2.49 51.48,11.37 U2.23 51.48,13.19 51.66,13.37 C82.2 v51.65,14.38 | C29.2 34.99,9.89 35.43,9.45 35.43,9.21
  Bottom 0.406: C1.1 C30.2 | R46.1 23.7,7.38 23.46,7.14 IC10.6